# EAGLE schematic Ubo_v1.6_led_topview (EAGLE 9.6.2)
Assembly variants: Variant_2

## Sheet 1 of 7: I2S Audio
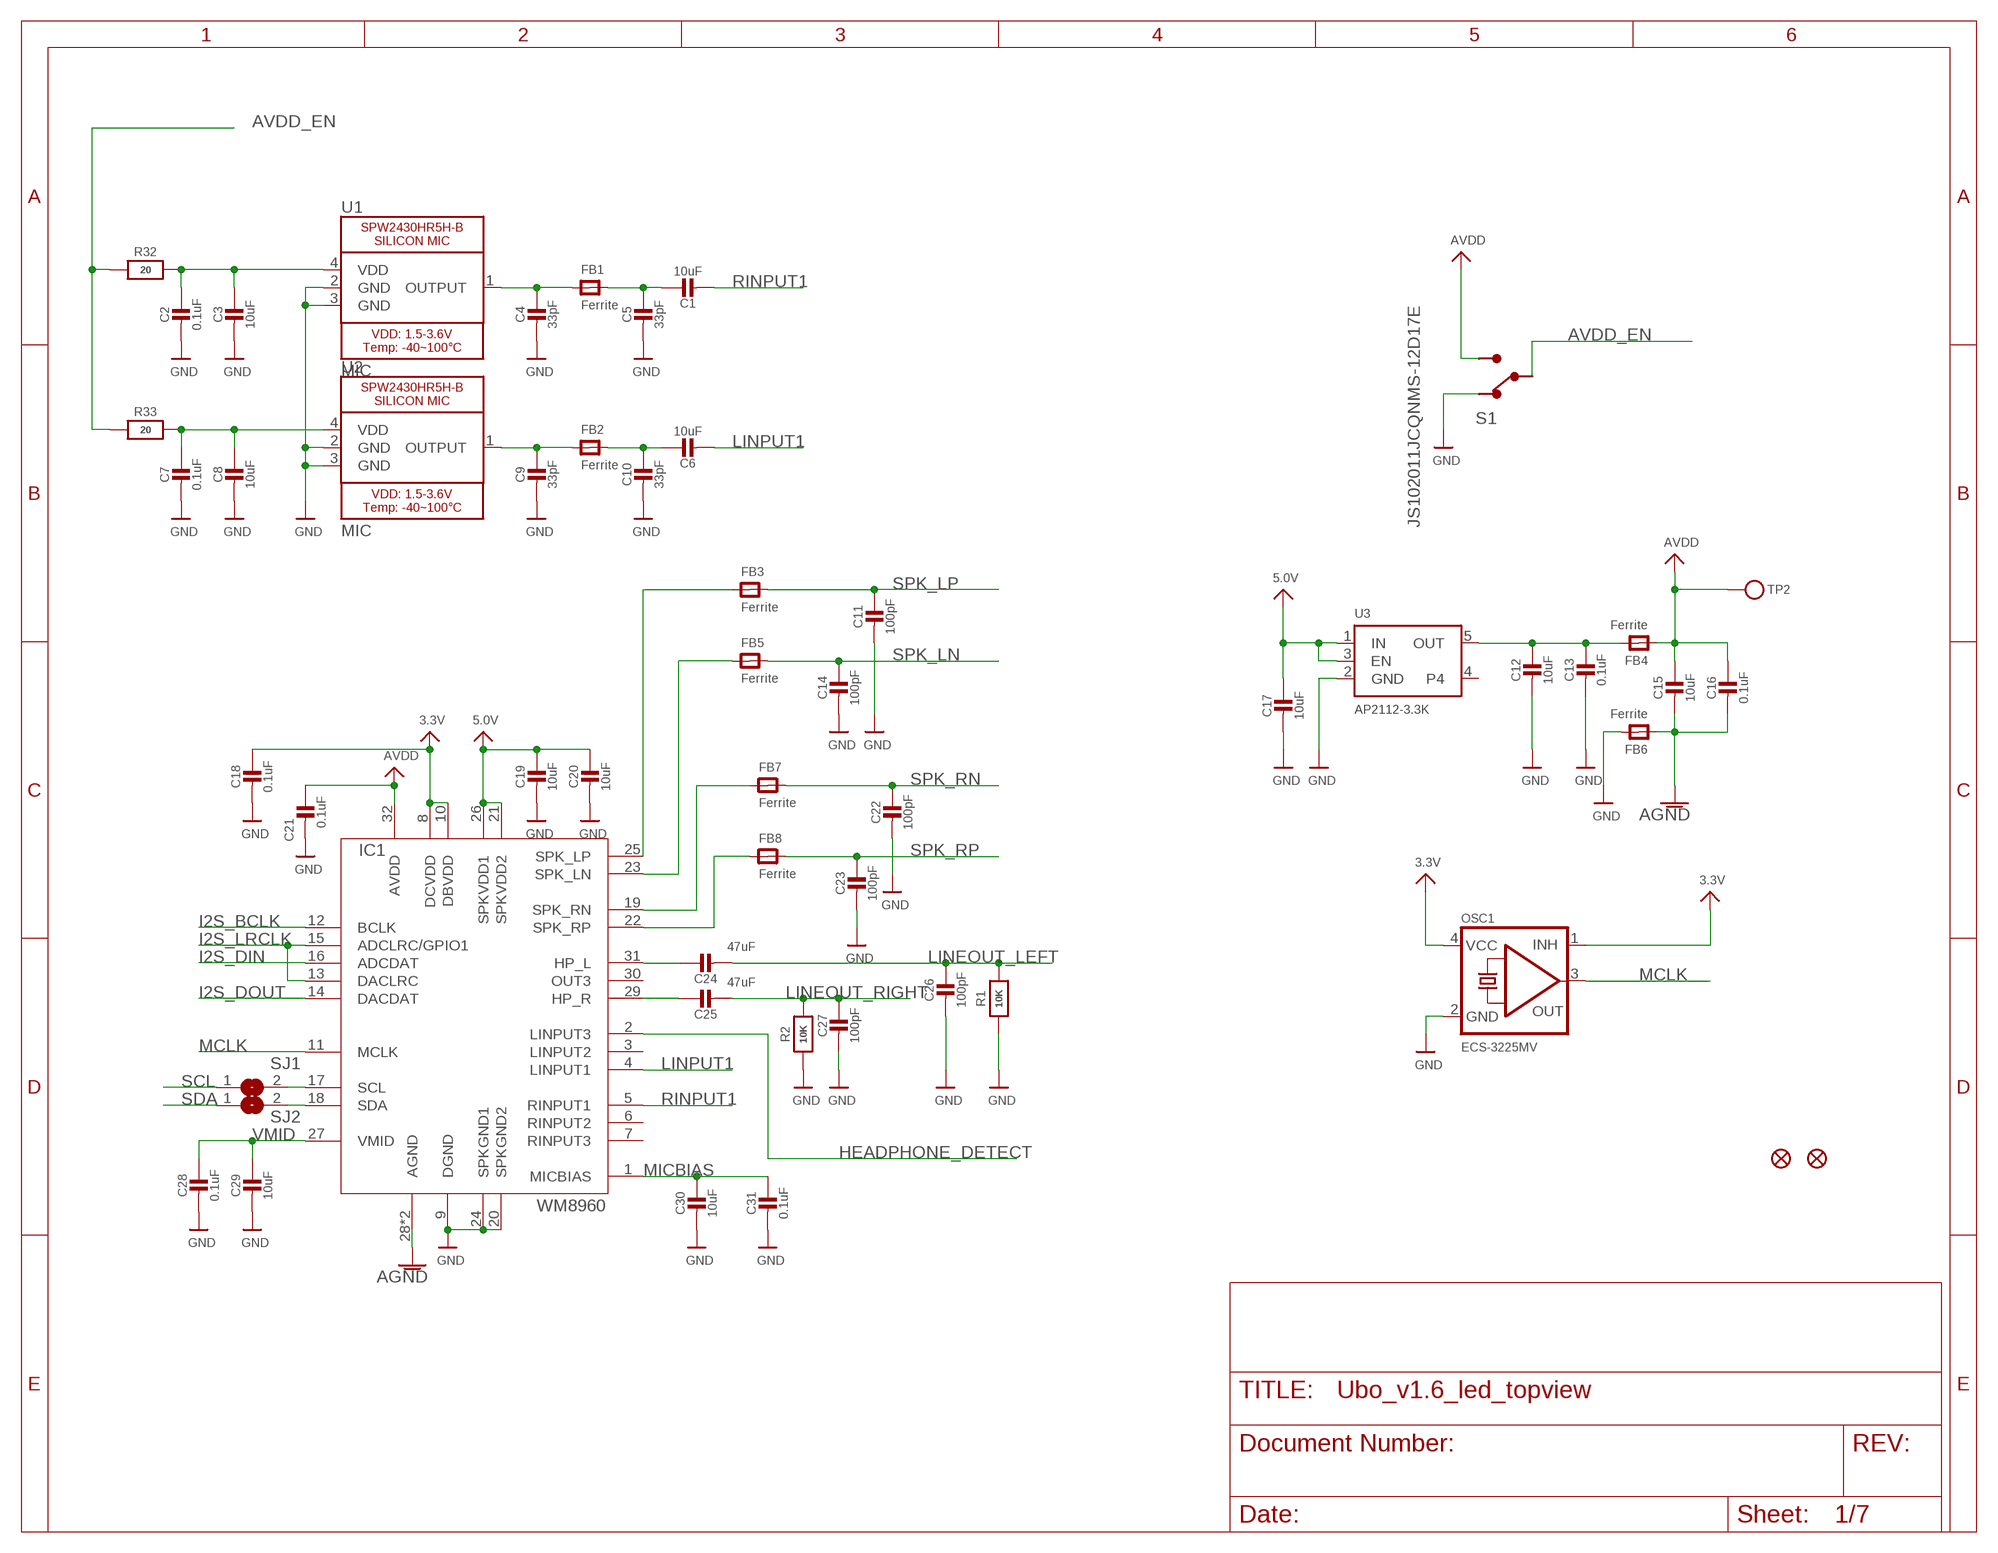
[diagram p0: schematic, sheet 1]

### Parts
C1  10uF  CAP_CERAMIC0805-NOOUTLINE  [0805-NO]  (not fitted in variant Variant_2)
C2  0.1uF  CAP_CERAMIC0603_NO  [0603-NO]  (not fitted in variant Variant_2)
C3  10uF  CAP_CERAMIC0805-NOOUTLINE  [0805-NO]  (not fitted in variant Variant_2)
C4  33pF  CAP_CERAMIC0603_NO  [0603-NO]  (not fitted in variant Variant_2)
C5  33pF  CAP_CERAMIC0603_NO  [0603-NO]  (not fitted in variant Variant_2)
C6  10uF  CAP_CERAMIC0805-NOOUTLINE  [0805-NO]  (not fitted in variant Variant_2)
C7  0.1uF  CAP_CERAMIC0603_NO  [0603-NO]  (not fitted in variant Variant_2)
C8  10uF  CAP_CERAMIC0805-NOOUTLINE  [0805-NO]  (not fitted in variant Variant_2)
C9  33pF  CAP_CERAMIC0603_NO  [0603-NO]  (not fitted in variant Variant_2)
C10  33pF  CAP_CERAMIC0603_NO  [0603-NO]  (not fitted in variant Variant_2)
C11  100pF  CAP_CERAMIC0603_NO  [0603-NO]  (not fitted in variant Variant_2)
C12  10uF  CAP_CERAMIC0805-NOOUTLINE  [0805-NO]  (not fitted in variant Variant_2)
C13  0.1uF  CAP_CERAMIC0603_NO  [0603-NO]  (not fitted in variant Variant_2)
C14  100pF  CAP_CERAMIC0603_NO  [0603-NO]  (not fitted in variant Variant_2)
C15  10uF  CAP_CERAMIC0805-NOOUTLINE  [0805-NO]  (not fitted in variant Variant_2)
C16  0.1uF  CAP_CERAMIC0603_NO  [0603-NO]  (not fitted in variant Variant_2)
C17  10uF  CAP_CERAMIC0805-NOOUTLINE  [0805-NO]  (not fitted in variant Variant_2)
C18  0.1uF  CAP_CERAMIC0603_NO  [0603-NO]  (not fitted in variant Variant_2)
C19  10uF  CAP_CERAMIC0805-NOOUTLINE  [0805-NO]  (not fitted in variant Variant_2)
C20  10uF  CAP_CERAMIC0805-NOOUTLINE  [0805-NO]  (not fitted in variant Variant_2)
C21  0.1uF  CAP_CERAMIC0603_NO  [0603-NO]  (not fitted in variant Variant_2)
C22  100pF  CAP_CERAMIC0603_NO  [0603-NO]  (not fitted in variant Variant_2)
C23  100pF  CAP_CERAMIC0603_NO  [0603-NO]  (not fitted in variant Variant_2)
C24  47uF  CAP_CERAMIC0805-NOOUTLINE  [0805-NO]  (not fitted in variant Variant_2)
C25  47uF  CAP_CERAMIC0805-NOOUTLINE  [0805-NO]  (not fitted in variant Variant_2)
C26  100pF  CAP_CERAMIC0603_NO  [0603-NO]  (not fitted in variant Variant_2)
C27  100pF  CAP_CERAMIC0603_NO  [0603-NO]  (not fitted in variant Variant_2)
C28  0.1uF  CAP_CERAMIC0603_NO  [0603-NO]  (not fitted in variant Variant_2)
C29  10uF  CAP_CERAMIC0805-NOOUTLINE  [0805-NO]  (not fitted in variant Variant_2)
C30  10uF  CAP_CERAMIC0805-NOOUTLINE  [0805-NO]  (not fitted in variant Variant_2)
C31  0.1uF  CAP_CERAMIC0603_NO  [0603-NO]  (not fitted in variant Variant_2)
FB1  Ferrite  FERRITE-0805NO  [0805-NO]  (not fitted in variant Variant_2)
FB2  Ferrite  FERRITE-0805NO  [0805-NO]  (not fitted in variant Variant_2)
FB3  Ferrite  FERRITE-0805NO  [0805-NO]  (not fitted in variant Variant_2)
FB4  Ferrite  FERRITE-0805NO  [0805-NO]  (not fitted in variant Variant_2)
FB5  Ferrite  FERRITE-0805NO  [0805-NO]  (not fitted in variant Variant_2)
FB6  Ferrite  FERRITE-0805NO  [0805-NO]  (not fitted in variant Variant_2)
FB7  Ferrite  FERRITE-0805NO  [0805-NO]  (not fitted in variant Variant_2)
FB8  Ferrite  FERRITE-0805NO  [0805-NO]  (not fitted in variant Variant_2)
FID1  FIDUCIAL_1MM  [FIDUCIAL_1MM]
FID2  FIDUCIAL_1MM  [FIDUCIAL_1MM]
IC1  WM8960  [QFN32_5MM]  (not fitted in variant Variant_2)
OSC1  ECS-3225MV  OSCILLATOR2.5X2  [OSC_2.5X2MM]  (not fitted in variant Variant_2)
R1  10K  RESISTOR_0603_NOOUT  [0603-NO]  (not fitted in variant Variant_2)
R2  10K  RESISTOR_0603_NOOUT  [0603-NO]  (not fitted in variant Variant_2)
R32  20  RESISTOR_0603_NOOUT  [0603-NO]  (not fitted in variant Variant_2)
R33  20  RESISTOR_0603_NOOUT  [0603-NO]  (not fitted in variant Variant_2)
S1  JS102011JCQNMS-12D17E  [SW_MS-12D17E]  (not fitted in variant Variant_2)
SJ1  SJ  [SJ]
SJ2  SJ  [SJ]
TP2  TESTPOINTROUND1MM  [TESTPOINT_ROUND_1MM]
U1  MIC  SPW2430HR5H-B  [SPW2430HR5H-B]  (not fitted in variant Variant_2)
U2  MIC  SPW2430HR5H-B  [SPW2430HR5H-B]  (not fitted in variant Variant_2)
U3  AP2112-3.3K  VREG_SOT23-5  [SOT23-5]  (not fitted in variant Variant_2)

### Nets
3.3V: C18.1 IC1.8(DCVDD) IC1.10(DBVDD) OSC1.1(INH) OSC1.4(VCC) ; also sheet 2,3,4,5,6
5.0V: C17.1 C19.1 C20.1 IC1.21(SPKVDD2) IC1.26(SPKVDD1) U3.1(IN) U3.3(EN) ; also sheet 3,4,7
AGND: C15.2 C16.2 FB6.1 IC1.28(AGND) IC1.33(AGND)
AVDD: C15.1 C16.1 C21.1 FB4.1 IC1.32(AVDD) S1.3 TP2.P$1
AVDD_EN: R32.2 R33.2 S1.2 ; also sheet 5
GND: C2.2 C3.2 C4.2 C5.2 C7.2 C8.2 C9.2 C10.2 C11.2 C12.2 C13.2 C14.2 C17.2 C18.2 C19.2 C20.2 C21.2 C22.2 C23.2 C26.2 C27.2 C28.2 C29.2 C30.2 C31.2 FB6.2 IC1.9(DGND) IC1.20(SPKGND2) IC1.24(SPKGND1) OSC1.2(GND) R1.1 R2.1 S1.1 U1.2(GND) U1.3(GND) U2.2(GND) U2.3(GND) U3.2(GND) ; also sheet 2,3,4,5,6,7
HEADPHONE_DETECT: IC1.2(LINPUT3) ; also sheet 3
I2S_BCLK: IC1.12(BCLK) ; also sheet 3
I2S_DIN: IC1.16(ADCDAT) ; also sheet 3
I2S_DOUT: IC1.14(DACDAT) ; also sheet 3
I2S_LRCLK: IC1.13(DACLRC) IC1.15(ADCLRC/GPIO1) ; also sheet 3
LINEOUT_LEFT: C24.2 C26.1 R1.2 ; also sheet 3
LINEOUT_RIGHT: C25.2 C27.1 R2.2 ; also sheet 3
LINPUT1: C6.2 IC1.4(LINPUT1)
MCLK: IC1.11(MCLK) OSC1.3(OUT)
MICBIAS: C30.1 C31.1 IC1.1(MICBIAS)
N$1: FB7.1 IC1.19(SPK_RN)
N$2: FB8.1 IC1.22(SPK_RP)
N$12: C4.1 FB1.1 U1.1(OUTPUT)
N$13: C9.1 FB2.1 U2.1(OUTPUT)
N$16: C1.1 C5.1 FB1.2
N$17: C6.1 C10.1 FB2.2
N$21: FB3.1 IC1.25(SPK_LP)
N$22: FB5.1 IC1.23(SPK_LN)
N$43: C24.1 IC1.31(HP_L)
N$44: C25.1 IC1.29(HP_R)
N$46: IC1.17(SCL) SJ1.2
N$47: IC1.18(SDA) SJ2.2
N$61: C7.1 C8.1 R33.1 U2.4(VDD)
N$62: C2.1 C3.1 R32.1 U1.4(VDD)
OUT: C12.1 C13.1 FB4.2 U3.5(OUT)
RINPUT1: C1.2 IC1.5(RINPUT1)
SCL: SJ1.1 ; also sheet 3,4,5,6
SDA: SJ2.1 ; also sheet 3,4,5,6
SPK_LN: C14.1 FB5.2 ; also sheet 3
SPK_LP: C11.1 FB3.2 ; also sheet 3
SPK_RN: C22.1 FB7.2 ; also sheet 3
SPK_RP: C23.1 FB8.2 ; also sheet 3
VMID: C28.1 C29.1 IC1.27(VMID)
Unconnected: IC1.3(LINPUT2) IC1.6(RINPUT2) IC1.7(RINPUT3) IC1.30(OUT3) U3.4

## Sheet 2 of 7: TFT Display and LED
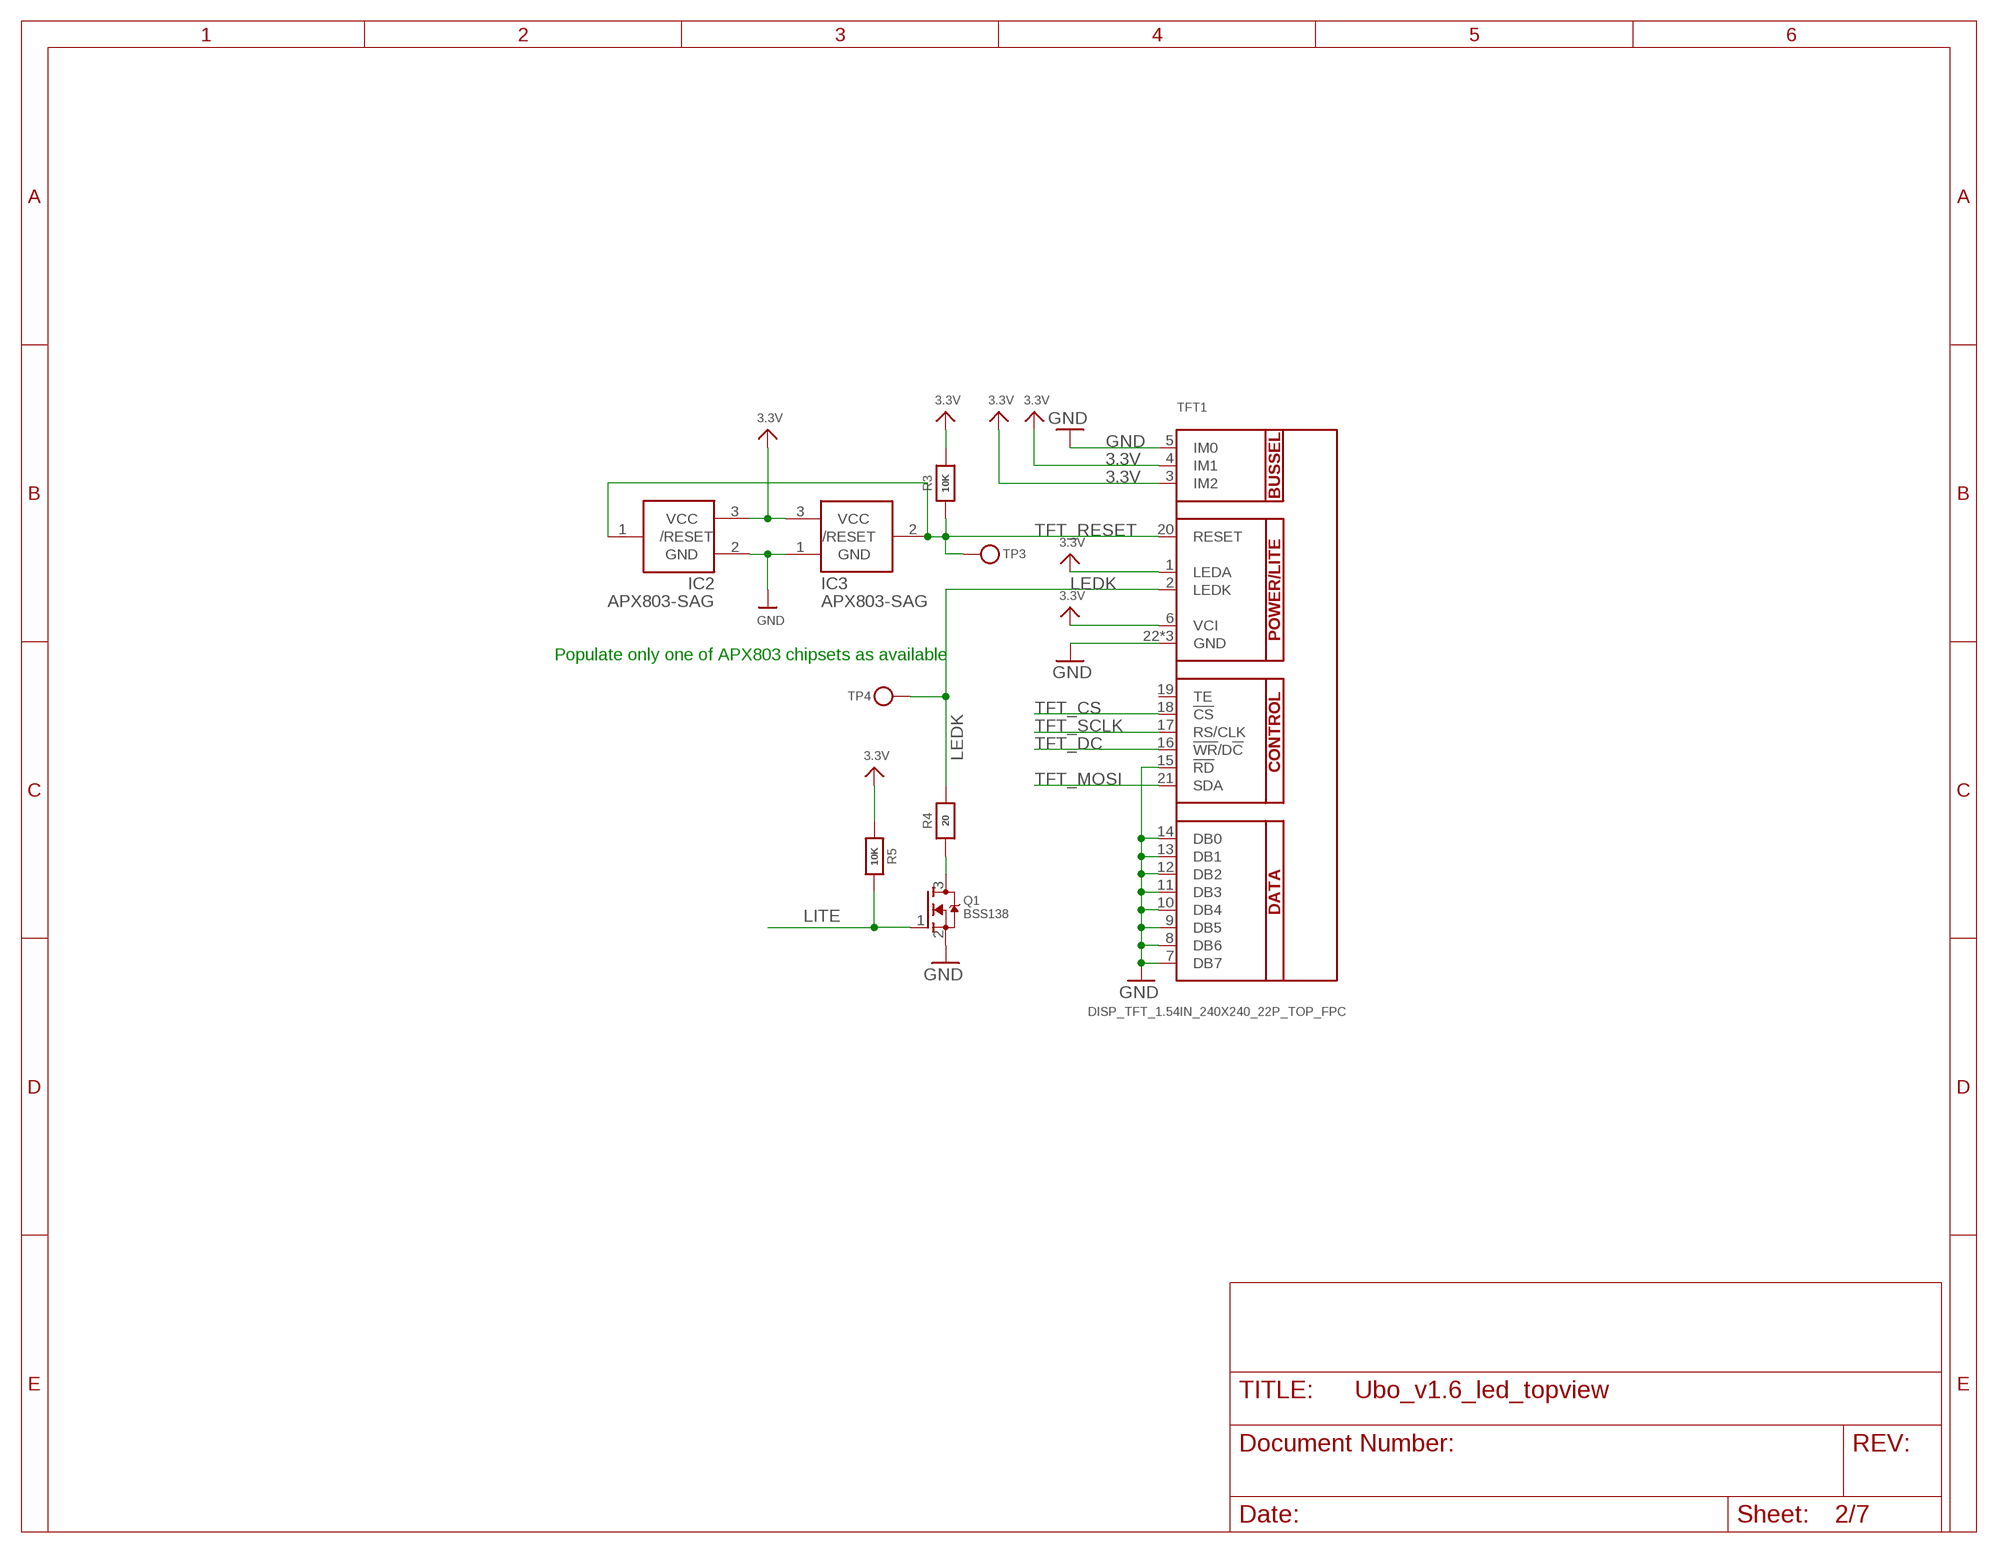
[diagram p1: schematic, sheet 2]

### Parts
IC2  APX803-SAG  AXP083APX803-SR  [SOT23]
IC3  APX803-SAG  AXP083-SAG  [SOT23]
Q1  BSS138  MOSFET-NWIDE  [SOT23-WIDE]
R3  10K  RESISTOR_0603_NOOUT  [0603-NO]
R4  20  RESISTOR_0603_NOOUT  [0603-NO]
R5  10K  RESISTOR_0603_NOOUT  [0603-NO]
TFT1  DISP_TFT_1.54IN_240X240_22P_TOP_FPC  [TFT_1.54IN_240X240_22PN_TOP_FPC]
TP3  TESTPOINTROUND1MM  [TESTPOINT_ROUND_1MM]
TP4  TESTPOINTROUND1MM  [TESTPOINT_ROUND_1MM]

### Nets
3.3V: IC2.3(VCC) IC3.3(VCC) R3.2 R5.2 TFT1.1(LEDA) TFT1.3(IM2) TFT1.4(IM1) TFT1.6(VCI) ; also sheet 1,3,4,5,6
GND: IC2.2(GND) IC3.1(GND) Q1.2(S) TFT1.5(IM0) TFT1.7(DB7) TFT1.8(DB6) TFT1.9(DB5) TFT1.10(DB4) TFT1.11(DB3) TFT1.12(DB2) TFT1.13(DB1) TFT1.14(DB0) TFT1.15(!RD) TFT1.22(GND) TFT1.SUPPORT1(GND) TFT1.SUPPORT2(GND) ; also sheet 1,3,4,5,6,7
LEDK: R4.2 TFT1.2(LEDK) TP4.P$1
LITE: Q1.1(G) R5.1 ; also sheet 3
N$4: Q1.3(D) R4.1
TFT_CS: TFT1.18(!CS) ; also sheet 3
TFT_DC: TFT1.16(!WR!/D!C) ; also sheet 3
TFT_MOSI: TFT1.21(SDA) ; also sheet 3
TFT_RESET: IC2.1(/RESET) IC3.2(/RESET) R3.1 TFT1.20(RESET) TP3.P$1
TFT_SCLK: TFT1.17(RS/CLK) ; also sheet 3
Unconnected: TFT1.19(TE)

### Notes on the sheet
- Populate only one of APX803 chipsets as available

## Sheet 3 of 7: RasPi Hat & Power
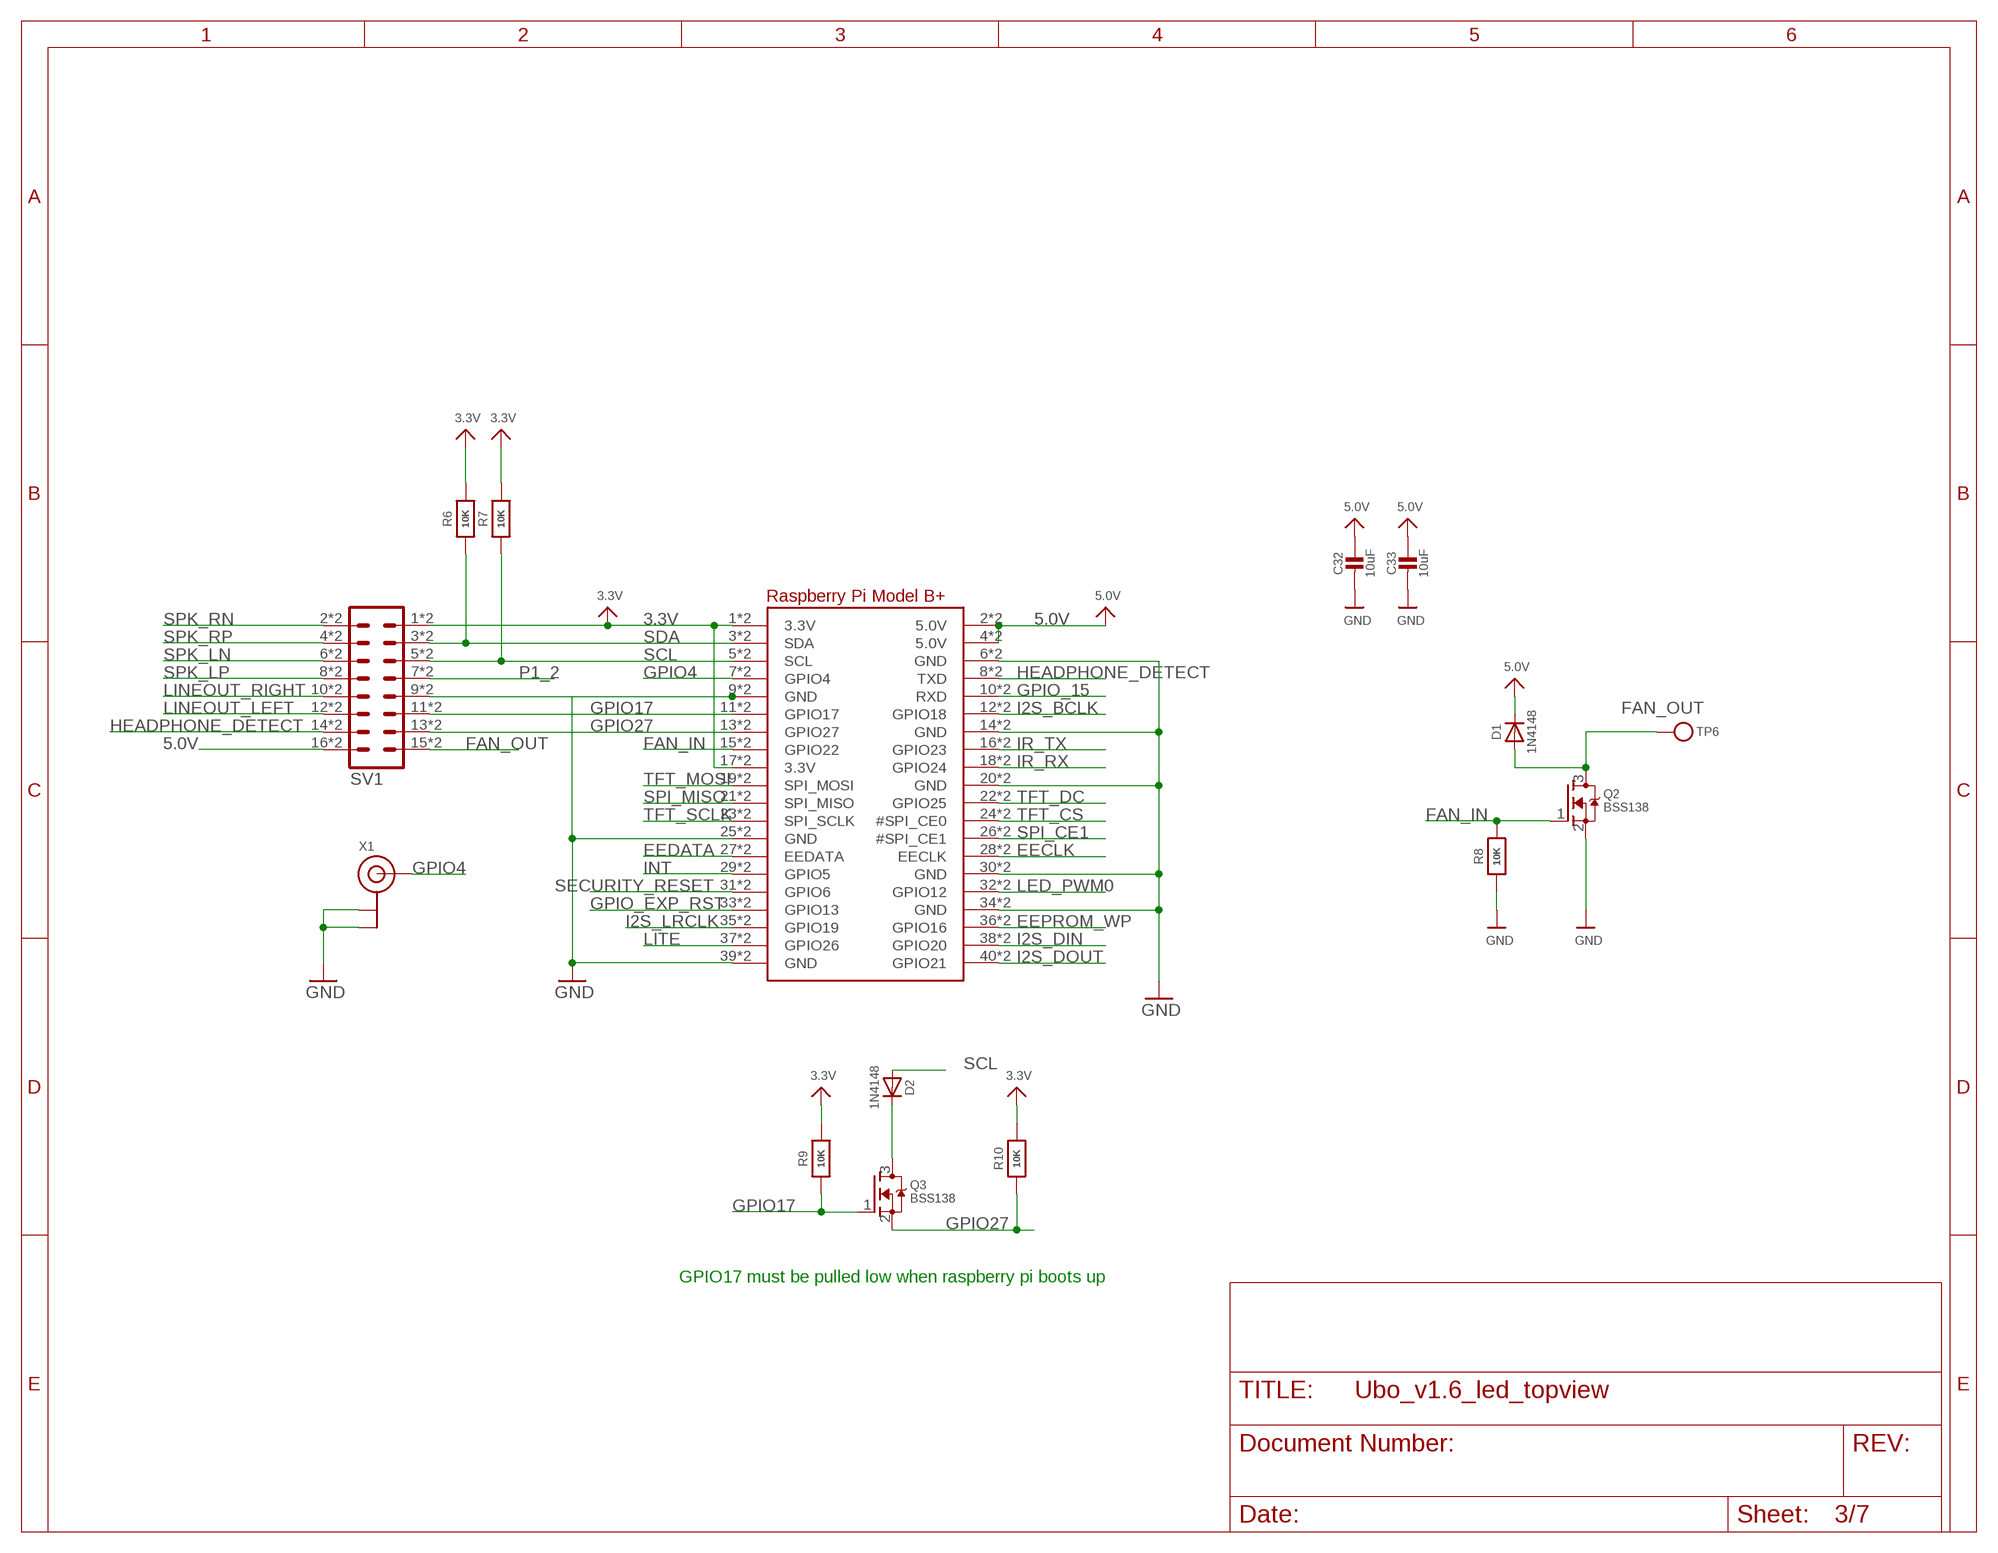
[diagram p2: schematic, sheet 3]

### Parts
C32  10uF  CAP_CERAMIC0805-NOOUTLINE  [0805-NO]
C33  10uF  CAP_CERAMIC0805-NOOUTLINE  [0805-NO]
D1  1N4148  DIODESOD-323  [SOD-323]
D2  1N4148  DIODESOD-323  [SOD-323]
Q2  BSS138  MOSFET-NWIDE  [SOT23-WIDE]
Q3  BSS138  MOSFET-NWIDE  [SOT23-WIDE]
R6  10K  RESISTOR_0603_NOOUT  [0603-NO]
R7  10K  RESISTOR_0603_NOOUT  [0603-NO]
R8  10K  RESISTOR_0603_NOOUT  [0603-NO]
R9  10K  RESISTOR_0603_NOOUT  [0603-NO]
R10  10K  RESISTOR_0603_NOOUT  [0603-NO]
RPI1  RASPBERRYPI_BPLUS_PIN_2X20_SMTTHM  [PI_PIN_2X20_SMTTHM]
SV1  MA08-2  [MA08-2]
TP6  TESTPOINTROUND1MM  [TESTPOINT_ROUND_1MM]
X1  ANTENNA_U.FL  [U.FL]  (not fitted in variant Variant_2)

### Nets
3.3V: R6.1 R7.1 R9.1 R10.1 RPI1.1(3.3V) RPI1.17(3.3V) RPI1.S1(3.3V) RPI1.S17(3.3V) SV1.1 SV1.P$1 ; also sheet 1,2,4,5,6
5.0V: C32.1 C33.1 D1.C RPI1.2(5.0V) RPI1.4(5.0V) RPI1.S2(5.0V) RPI1.S4(5.0V) SV1.16 SV1.P$16 ; also sheet 1,4,7
EECLK: RPI1.28(EECLK) RPI1.S28(EECLK) ; also sheet 6
EEDATA: RPI1.27(EEDATA) RPI1.S27(EEDATA) ; also sheet 6
EEPROM_WP: RPI1.36(GPIO16) RPI1.S36(GPIO16) ; also sheet 6
FAN_IN: Q2.1(G) R8.1 RPI1.15(GPIO22) RPI1.S15(GPIO22)
FAN_OUT: D1.A Q2.3(D) SV1.15 SV1.P$15 TP6.P$1
GND: C32.2 C33.2 Q2.2(S) R8.2 RPI1.6(GND) RPI1.9(GND) RPI1.14(GND) RPI1.20(GND) RPI1.25(GND) RPI1.30(GND) RPI1.34(GND) RPI1.39(GND) RPI1.S6(GND) RPI1.S9(GND) RPI1.S14(GND) RPI1.S20(GND) RPI1.S25(GND) RPI1.S30(GND) RPI1.S34(GND) RPI1.S39(GND) SV1.9 SV1.P$9 X1.1(GND) X1.2(GND) ; also sheet 1,2,4,5,6,7
GPIO4: RPI1.7(GPIO4) RPI1.S7(GPIO4) X1.3(SIGNAL)
GPIO17: Q3.1(G) R9.2 RPI1.11(GPIO17) RPI1.S11(GPIO17) SV1.11 SV1.P$11
GPIO27: Q3.2(S) R10.2 RPI1.13(GPIO27) RPI1.S13(GPIO27) SV1.13 SV1.P$13
GPIO_15: RPI1.10(RXD) RPI1.S10(RXD)
GPIO_EXP_RST: RPI1.33(GPIO13) RPI1.S33(GPIO13) ; also sheet 5
HEADPHONE_DETECT: RPI1.8(TXD) RPI1.S8(TXD) SV1.14 SV1.P$14 ; also sheet 1
I2S_BCLK: RPI1.12(GPIO18) RPI1.S12(GPIO18) ; also sheet 1
I2S_DIN: RPI1.38(GPIO20) RPI1.S38(GPIO20) ; also sheet 1
I2S_DOUT: RPI1.40(GPIO21) RPI1.S40(GPIO21) ; also sheet 1
I2S_LRCLK: RPI1.35(GPIO19) RPI1.S35(GPIO19) ; also sheet 1
INT: RPI1.29(GPIO5) RPI1.S29(GPIO5) ; also sheet 5
IR_RX: RPI1.18(GPIO24) RPI1.S18(GPIO24) ; also sheet 4
IR_TX: RPI1.16(GPIO23) RPI1.S16(GPIO23) ; also sheet 4
LED_PWM0: RPI1.32(GPIO12) RPI1.S32(GPIO12) ; also sheet 7
LINEOUT_LEFT: SV1.12 SV1.P$12 ; also sheet 1
LINEOUT_RIGHT: SV1.10 SV1.P$10 ; also sheet 1
LITE: RPI1.37(GPIO26) RPI1.S37(GPIO26) ; also sheet 2
N$8: D2.C Q3.3(D)
P1_2: SV1.7 SV1.P$7 ; also sheet 5
SCL: D2.A R7.2 RPI1.5(SCL) RPI1.S5(SCL) SV1.5 SV1.P$5 ; also sheet 1,4,5,6
SDA: R6.2 RPI1.3(SDA) RPI1.S3(SDA) SV1.3 SV1.P$3 ; also sheet 1,4,5,6
SECURITY_RESET: RPI1.31(GPIO6) RPI1.S31(GPIO6) ; also sheet 6
SPI_CE1: RPI1.26(#SPI_CE1) RPI1.S26(#SPI_CE1)
SPI_MISO: RPI1.21(SPI_MISO) RPI1.S21(SPI_MISO)
SPK_LN: SV1.6 SV1.P$6 ; also sheet 1
SPK_LP: SV1.8 SV1.P$8 ; also sheet 1
SPK_RN: SV1.2 SV1.P$2 ; also sheet 1
SPK_RP: SV1.4 SV1.P$4 ; also sheet 1
TFT_CS: RPI1.24(#SPI_CE0) RPI1.S24(#SPI_CE0) ; also sheet 2
TFT_DC: RPI1.22(GPIO25) RPI1.S22(GPIO25) ; also sheet 2
TFT_MOSI: RPI1.19(SPI_MOSI) RPI1.S19(SPI_MOSI) ; also sheet 2
TFT_SCLK: RPI1.23(SPI_SCLK) RPI1.S23(SPI_SCLK) ; also sheet 2

### Notes on the sheet
- GPIO17 must be pulled low when raspberry pi boots up

## Sheet 4 of 7: Sensors
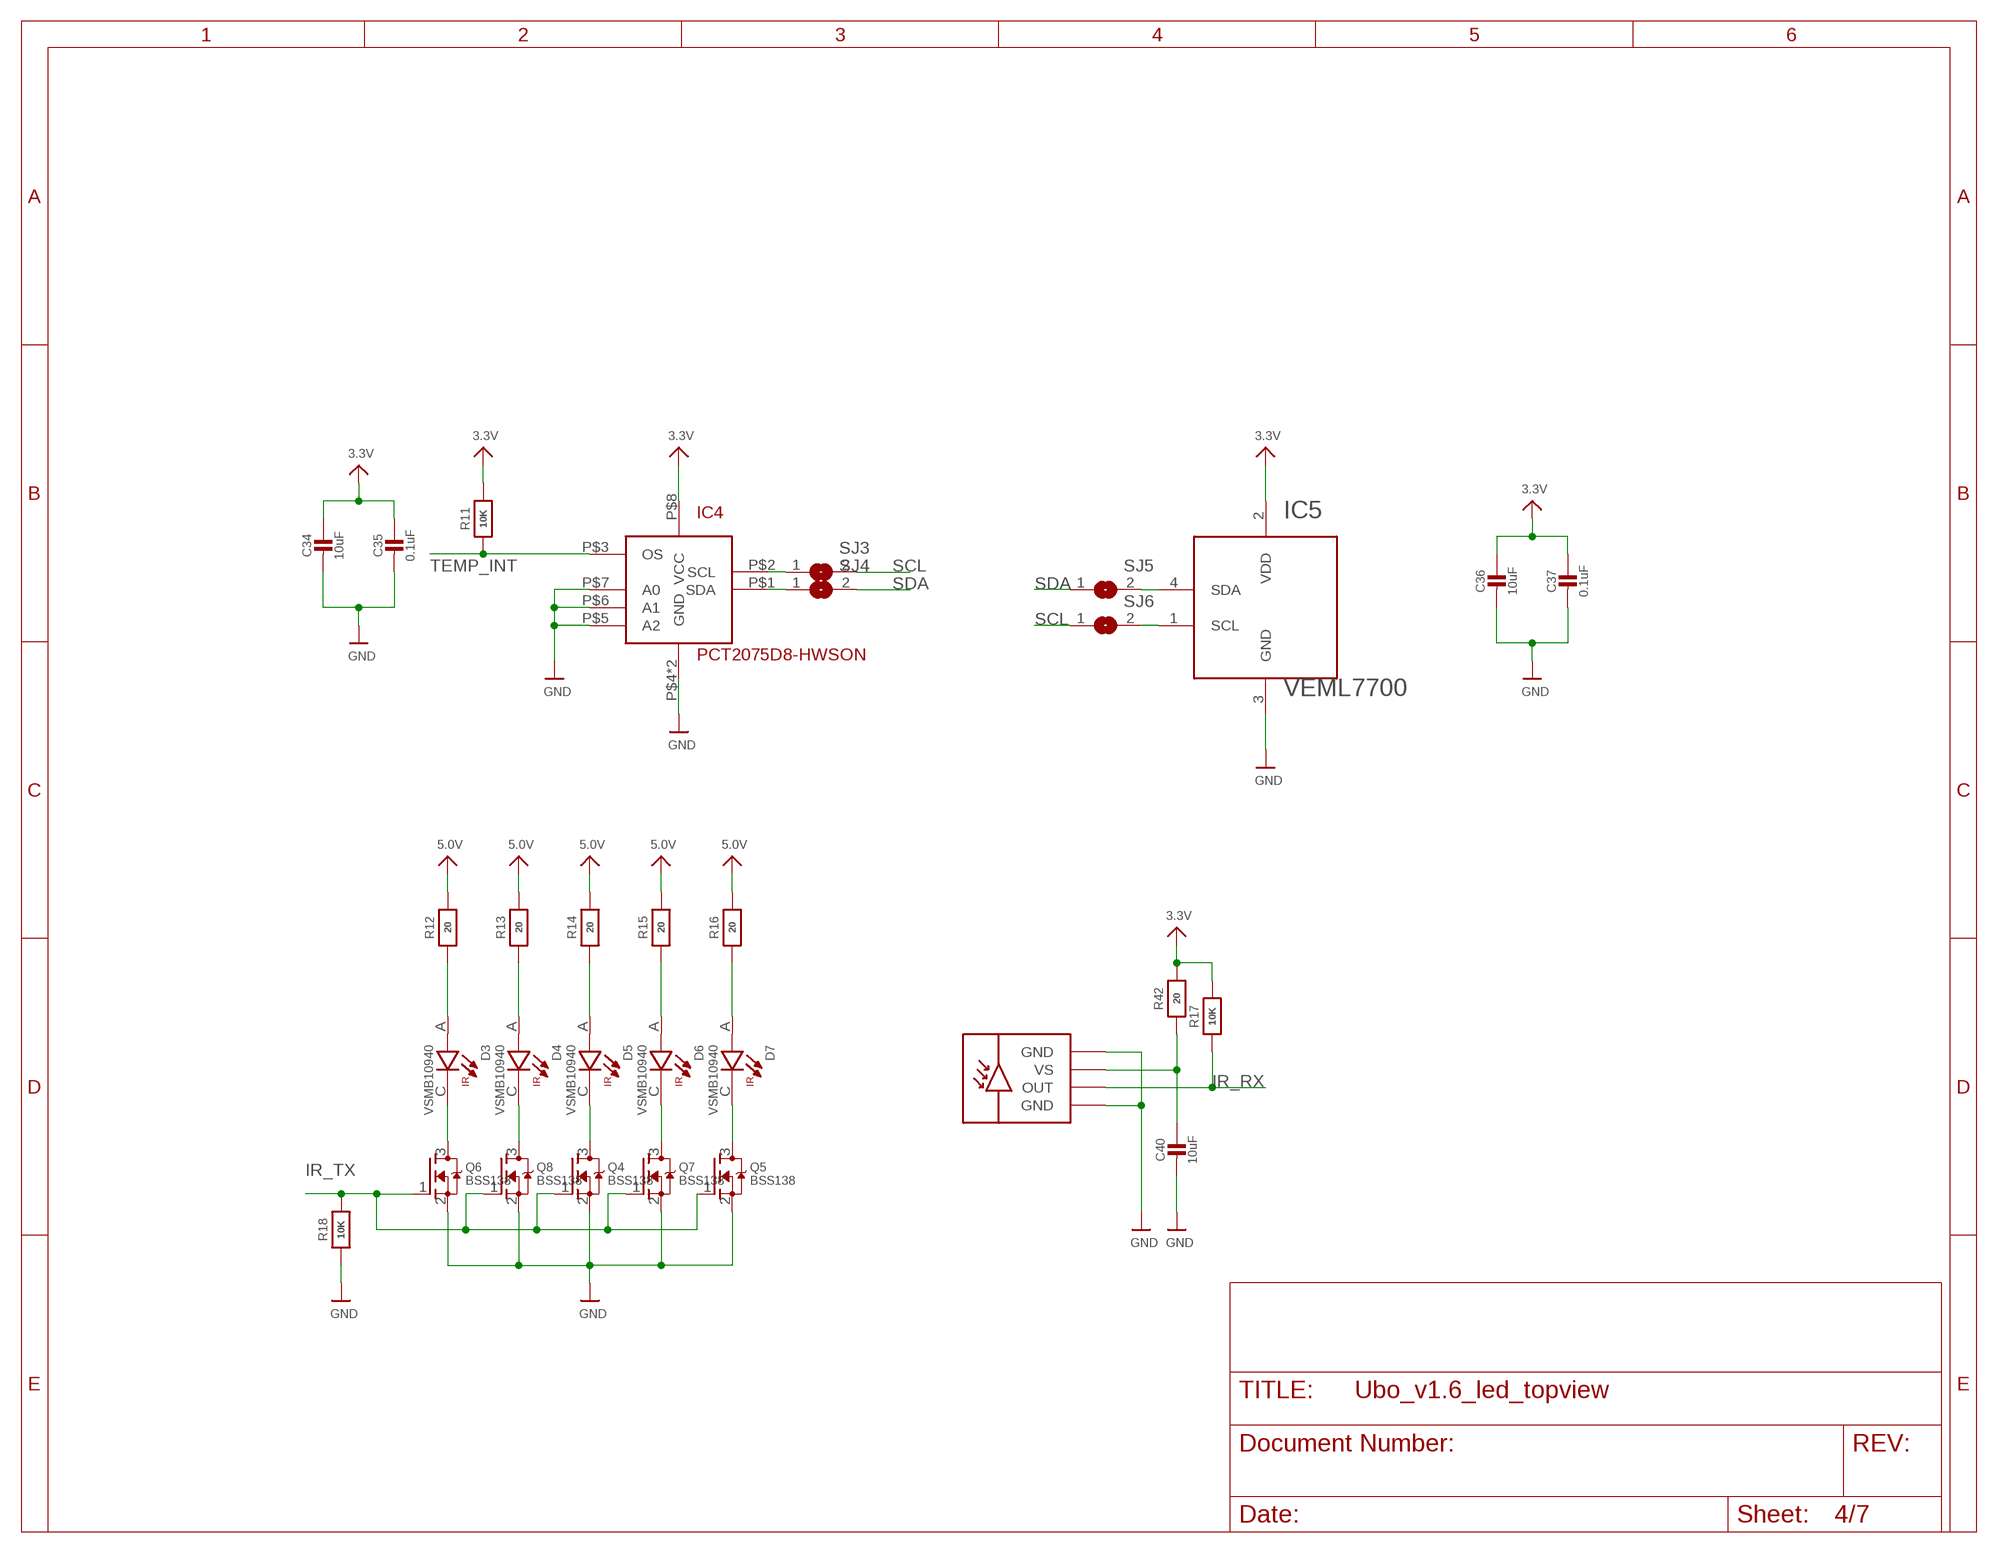
[diagram p3: schematic, sheet 4]

### Parts
C34  10uF  CAP_CERAMIC0805-NOOUTLINE  [0805-NO]
C35  0.1uF  CAP_CERAMIC0603_NO  [0603-NO]
C36  10uF  CAP_CERAMIC0805-NOOUTLINE  [0805-NO]
C37  0.1uF  CAP_CERAMIC0603_NO  [0603-NO]
C40  10uF  CAP_CERAMIC0805-NOOUTLINE  [0805-NO]
D3  VSMB10940  [DIO_VSMB10940]  (not fitted in variant Variant_2)
D4  VSMB10940  [DIO_VSMB10940]  (not fitted in variant Variant_2)
D5  VSMB10940  [DIO_VSMB10940]  (not fitted in variant Variant_2)
D6  VSMB10940  [DIO_VSMB10940]  (not fitted in variant Variant_2)
D7  VSMB10940  [DIO_VSMB10940]  (not fitted in variant Variant_2)
IC4  PCT2075D8-HWSON  [SON127P600X800X80-9N]  (not fitted in variant Variant_2)
IC5  VEML7700  [VEML7700]  (not fitted in variant Variant_2)
IR1  TSMP77000  [TSMP77000]  (not fitted in variant Variant_2)
Q4  BSS138  MOSFET-NWIDE  [SOT23-WIDE]
Q5  BSS138  MOSFET-NWIDE  [SOT23-WIDE]
Q6  BSS138  MOSFET-NWIDE  [SOT23-WIDE]
Q7  BSS138  MOSFET-NWIDE  [SOT23-WIDE]
Q8  BSS138  MOSFET-NWIDE  [SOT23-WIDE]
R11  10K  RESISTOR_0603_NOOUT  [0603-NO]
R12  20  RESISTOR_0603_NOOUT  [0603-NO]
R13  20  RESISTOR_0603_NOOUT  [0603-NO]
R14  20  RESISTOR_0603_NOOUT  [0603-NO]
R15  20  RESISTOR_0603_NOOUT  [0603-NO]
R16  20  RESISTOR_0603_NOOUT  [0603-NO]
R17  10K  RESISTOR_0603_NOOUT  [0603-NO]
R18  10K  RESISTOR_0603_NOOUT  [0603-NO]
R42  20  RESISTOR_0603_NOOUT  [0603-NO]
SJ3  SJ  [SJ]
SJ4  SJ  [SJ]
SJ5  SJ  [SJ]
SJ6  SJ  [SJ]

### Nets
3.3V: C34.1 C35.1 C36.1 C37.1 IC4.P$8(VCC) IC5.2(VDD) R11.1 R17.1 R42.1 ; also sheet 1,2,3,5,6
5.0V: R12.1 R13.1 R14.1 R15.1 R16.1 ; also sheet 1,3,7
GND: C34.2 C35.2 C36.2 C37.2 C40.2 IC4.P$4(GND) IC4.P$5(A2) IC4.P$6(A1) IC4.P$7(A0) IC4.P$9(GND) IC5.3(GND) IR1.P$1(GND) IR1.P$4(GND) Q4.2(S) Q5.2(S) Q6.2(S) Q7.2(S) Q8.2(S) R18.2 ; also sheet 1,2,3,5,6,7
IR_RX: IR1.P$3(OUT) R17.2 ; also sheet 3
IR_TX: Q4.1(G) Q5.1(G) Q6.1(G) Q7.1(G) Q8.1(G) R18.1 ; also sheet 3
N$6: D7.A R16.2
N$7: D3.C Q6.3(D)
N$48: IC5.4(SDA) SJ5.2
N$49: IC5.1(SCL) SJ6.2
N$50: IC4.P$2(SCL) SJ3.1
N$51: IC4.P$1(SDA) SJ4.1
N$54: D6.A R15.2
N$55: D5.A R14.2
N$56: D4.A R13.2
N$57: D3.A R12.2
N$66: D5.C Q4.3(D)
N$67: D4.C Q8.3(D)
N$68: D6.C Q7.3(D)
N$69: D7.C Q5.3(D)
N$70: C40.1 IR1.P$2(VS) R42.2
SCL: SJ3.2 SJ6.1 ; also sheet 1,3,5,6
SDA: SJ4.2 SJ5.1 ; also sheet 1,3,5,6
TEMP_INT: IC4.P$3(OS) R11.2 ; also sheet 5

## Sheet 5 of 7: Buttons and GPIO expansion
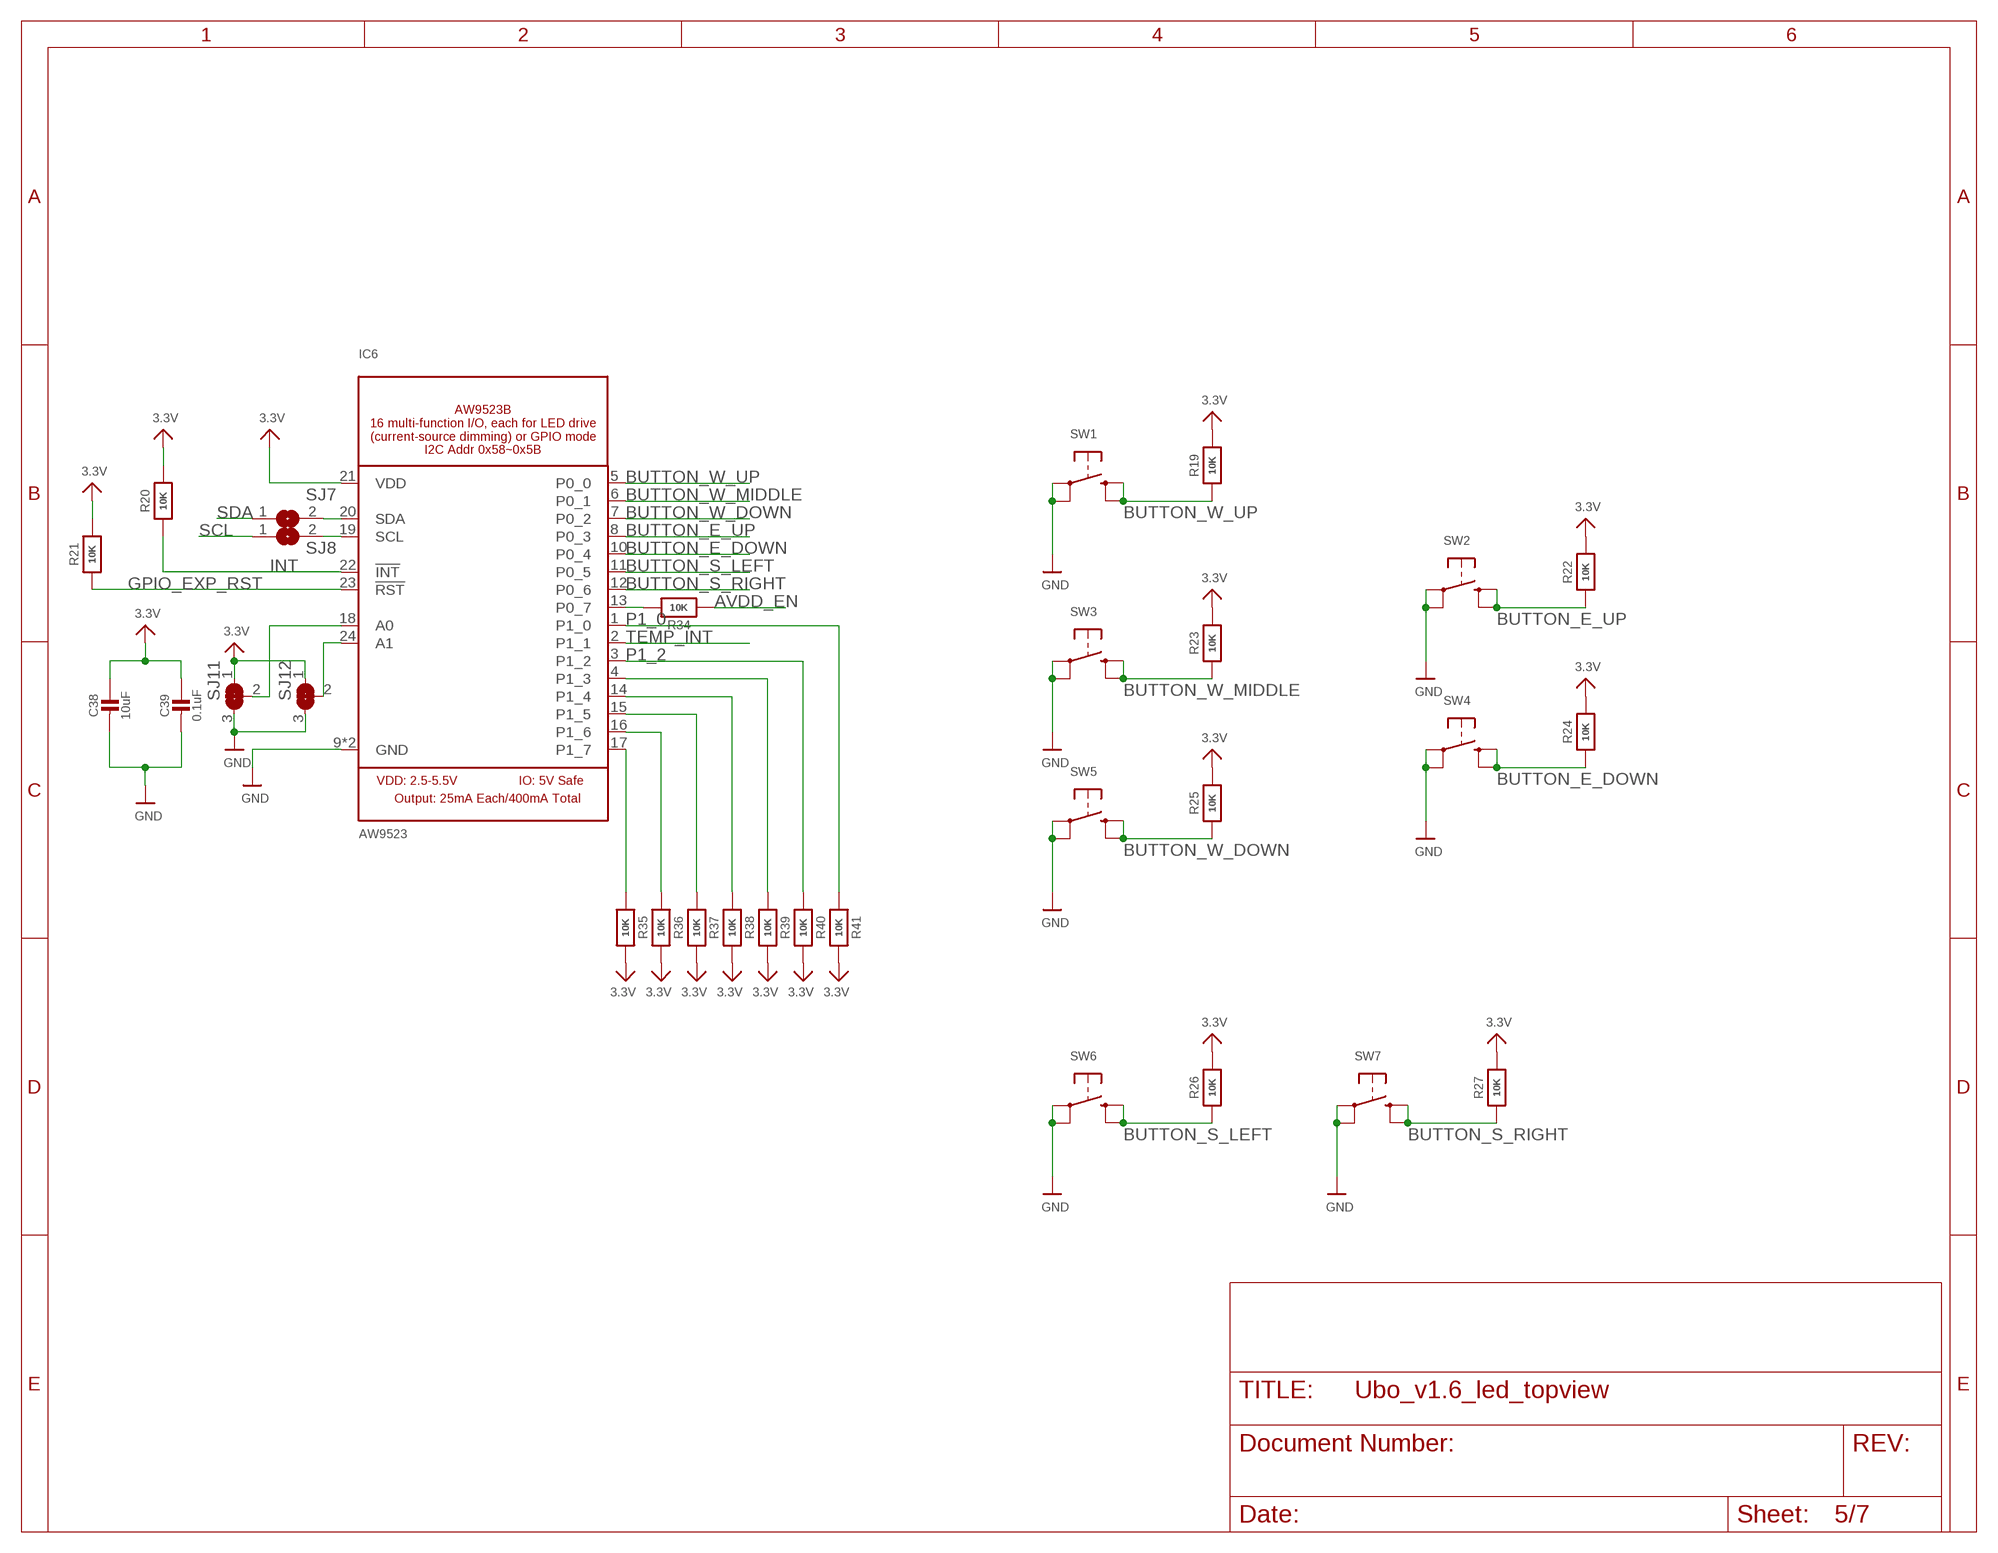
[diagram p4: schematic, sheet 5]

### Parts
C38  10uF  CAP_CERAMIC0805-NOOUTLINE  [0805-NO]
C39  0.1uF  CAP_CERAMIC0603_NO  [0603-NO]
IC6  AW9523  [QFN24_4MM_SMSC]
R19  10K  RESISTOR_0603_NOOUT  [0603-NO]
R20  10K  RESISTOR_0603_NOOUT  [0603-NO]
R21  10K  RESISTOR_0603_NOOUT  [0603-NO]
R22  10K  RESISTOR_0603_NOOUT  [0603-NO]
R23  10K  RESISTOR_0603_NOOUT  [0603-NO]
R24  10K  RESISTOR_0603_NOOUT  [0603-NO]
R25  10K  RESISTOR_0603_NOOUT  [0603-NO]
R26  10K  RESISTOR_0603_NOOUT  [0603-NO]
R27  10K  RESISTOR_0603_NOOUT  [0603-NO]
R34  10K  RESISTOR_0603_NOOUT  [0603-NO]
R35  10K  RESISTOR_0603_NOOUT  [0603-NO]
R36  10K  RESISTOR_0603_NOOUT  [0603-NO]
R37  10K  RESISTOR_0603_NOOUT  [0603-NO]
R38  10K  RESISTOR_0603_NOOUT  [0603-NO]
R39  10K  RESISTOR_0603_NOOUT  [0603-NO]
R40  10K  RESISTOR_0603_NOOUT  [0603-NO]
R41  10K  RESISTOR_0603_NOOUT  [0603-NO]
SJ7  SJ  [SJ]
SJ8  SJ  [SJ]
SJ11  SOLDERJUMPER_2WAY  [SOLDERJUMPER_2WAY_OPEN_NOPASTE]
SJ12  SOLDERJUMPER_2WAY  [SOLDERJUMPER_2WAY_OPEN_NOPASTE]
SW1  E-SWITCH_TL3315NF160QE-SWITCH_TL3315NF160Q_0_0  [E-SWITCH_TL3315NF160Q_0]
SW2  E-SWITCH_TL3315NF160QE-SWITCH_TL3315NF160Q_0_0  [E-SWITCH_TL3315NF160Q_0]
SW3  E-SWITCH_TL3315NF160QE-SWITCH_TL3315NF160Q_0_0  [E-SWITCH_TL3315NF160Q_0]
SW4  E-SWITCH_TL3315NF160QE-SWITCH_TL3315NF160Q_0_0  [E-SWITCH_TL3315NF160Q_0]
SW5  E-SWITCH_TL3315NF160QE-SWITCH_TL3315NF160Q_0_0  [E-SWITCH_TL3315NF160Q_0]
SW6  E-SWITCH_TL3315NF160QE-SWITCH_TL3315NF160Q_0_0  [E-SWITCH_TL3315NF160Q_0]
SW7  E-SWITCH_TL3315NF160QE-SWITCH_TL3315NF160Q_0_0  [E-SWITCH_TL3315NF160Q_0]

### Nets
3.3V: C38.1 C39.1 IC6.21(VDD) R19.1 R20.1 R21.1 R22.1 R23.1 R24.1 R25.1 R26.1 R27.1 R35.1 R36.1 R37.1 R38.1 R39.1 R40.1 R41.1 SJ11.1 SJ12.1 ; also sheet 1,2,3,4,6
AVDD_EN: R34.2 ; also sheet 1
BUTTON_E_DOWN: IC6.10(P0_4) R24.2 SW4.3 SW4.3-2 SW4.4 SW4.4-2
BUTTON_E_UP: IC6.8(P0_3) R22.2 SW2.3 SW2.3-2 SW2.4 SW2.4-2
BUTTON_S_LEFT: IC6.11(P0_5) R26.2 SW6.3 SW6.3-2 SW6.4 SW6.4-2
BUTTON_S_RIGHT: IC6.12(P0_6) R27.2 SW7.3 SW7.3-2 SW7.4 SW7.4-2
BUTTON_W_DOWN: IC6.7(P0_2) R25.2 SW5.3 SW5.3-2 SW5.4 SW5.4-2
BUTTON_W_MIDDLE: IC6.6(P0_1) R23.2 SW3.3 SW3.3-2 SW3.4 SW3.4-2
BUTTON_W_UP: IC6.5(P0_0) R19.2 SW1.3 SW1.3-2 SW1.4 SW1.4-2
GND: C38.2 C39.2 IC6.9(GND) IC6.THERM(GND) SJ11.3 SJ12.3 SW1.1 SW1.1-2 SW1.2 SW1.2-2 SW2.1 SW2.1-2 SW2.2 SW2.2-2 SW3.1 SW3.1-2 SW3.2 SW3.2-2 SW4.1 SW4.1-2 SW4.2 SW4.2-2 SW5.1 SW5.1-2 SW5.2 SW5.2-2 SW6.1 SW6.1-2 SW6.2 SW6.2-2 SW7.1 SW7.1-2 SW7.2 SW7.2-2 ; also sheet 1,2,3,4,6,7
GPIO_EXP_RST: IC6.23(!RST) R21.2 ; also sheet 3
INT: IC6.22(!INT) R20.2 ; also sheet 3
N$5: IC6.20(SDA) SJ7.2
N$9: IC6.19(SCL) SJ8.2
N$10: IC6.4(P1_3) R39.2
N$11: IC6.14(P1_4) R38.2
N$19: IC6.15(P1_5) R37.2
N$38: IC6.16(P1_6) R36.2
N$45: IC6.17(P1_7) R35.2
N$63: IC6.13(P0_7) R34.1
N$64: IC6.24(A1) SJ12.2
N$65: IC6.18(A0) SJ11.2
P1_0: IC6.1(P1_0) R41.2
P1_2: IC6.3(P1_2) R40.2 ; also sheet 3
SCL: SJ8.1 ; also sheet 1,3,4,6
SDA: SJ7.1 ; also sheet 1,3,4,6
TEMP_INT: IC6.2(P1_1) ; also sheet 4

## Sheet 6 of 7: EEPROM & SECURITY
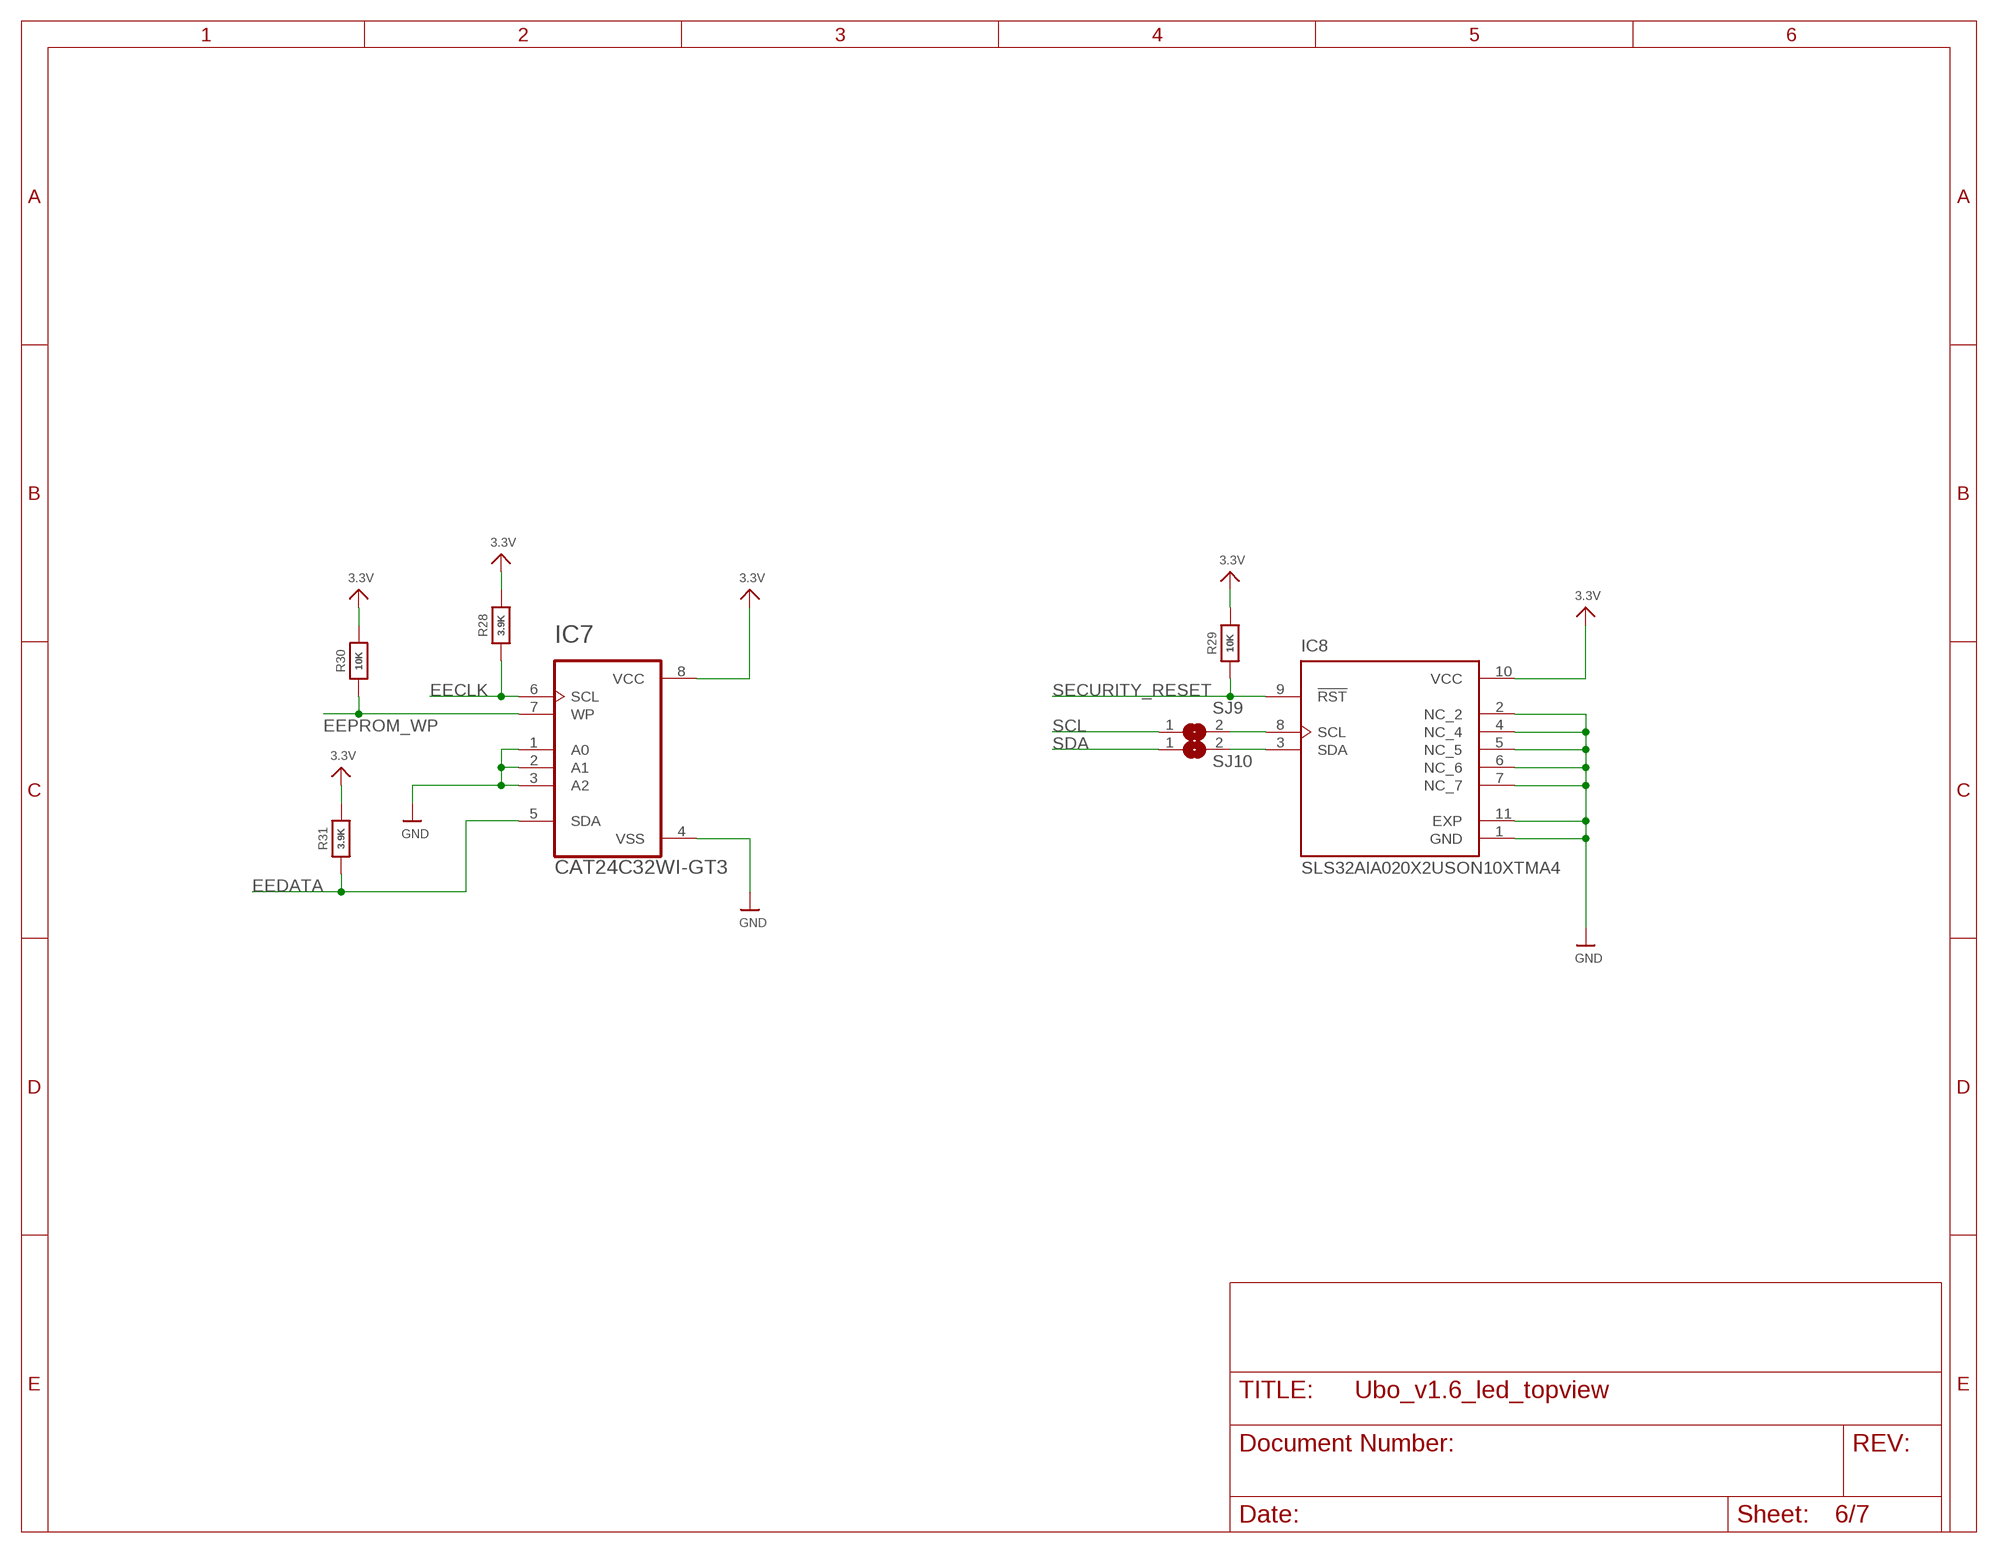
[diagram p5: schematic, sheet 6]

### Parts
IC7  CAT24C32WI-GT3  [SOIC127P600X175-8N]
IC8  SLS32AIA020X2USON10XTMA4  [SON50P300X300X60-11N]  (not fitted in variant Variant_2)
R28  3.9K  RESISTOR_0603_NOOUT  [0603-NO]
R29  10K  RESISTOR_0603_NOOUT  [0603-NO]
R30  10K  RESISTOR_0603_NOOUT  [0603-NO]
R31  3.9K  RESISTOR_0603_NOOUT  [0603-NO]
SJ9  SJ  [SJ]
SJ10  SJ  [SJ]

### Nets
3.3V: IC7.8(VCC) IC8.10(VCC) R28.1 R29.1 R30.1 R31.1 ; also sheet 1,2,3,4,5
EECLK: IC7.6(SCL) R28.2 ; also sheet 3
EEDATA: IC7.5(SDA) R31.2 ; also sheet 3
EEPROM_WP: IC7.7(WP) R30.2 ; also sheet 3
GND: IC7.1(A0) IC7.2(A1) IC7.3(A2) IC7.4(VSS) IC8.1(GND) IC8.2(NC_2) IC8.4(NC_4) IC8.5(NC_5) IC8.6(NC_6) IC8.7(NC_7) IC8.11(EXP) ; also sheet 1,2,3,4,5,7
N$52: IC8.8(SCL) SJ9.2
N$53: IC8.3(SDA) SJ10.2
SCL: SJ9.1 ; also sheet 1,3,4,5
SDA: SJ10.1 ; also sheet 1,3,4,5
SECURITY_RESET: IC8.9(!RST) R29.2 ; also sheet 3

## Sheet 7 of 7: LEDs
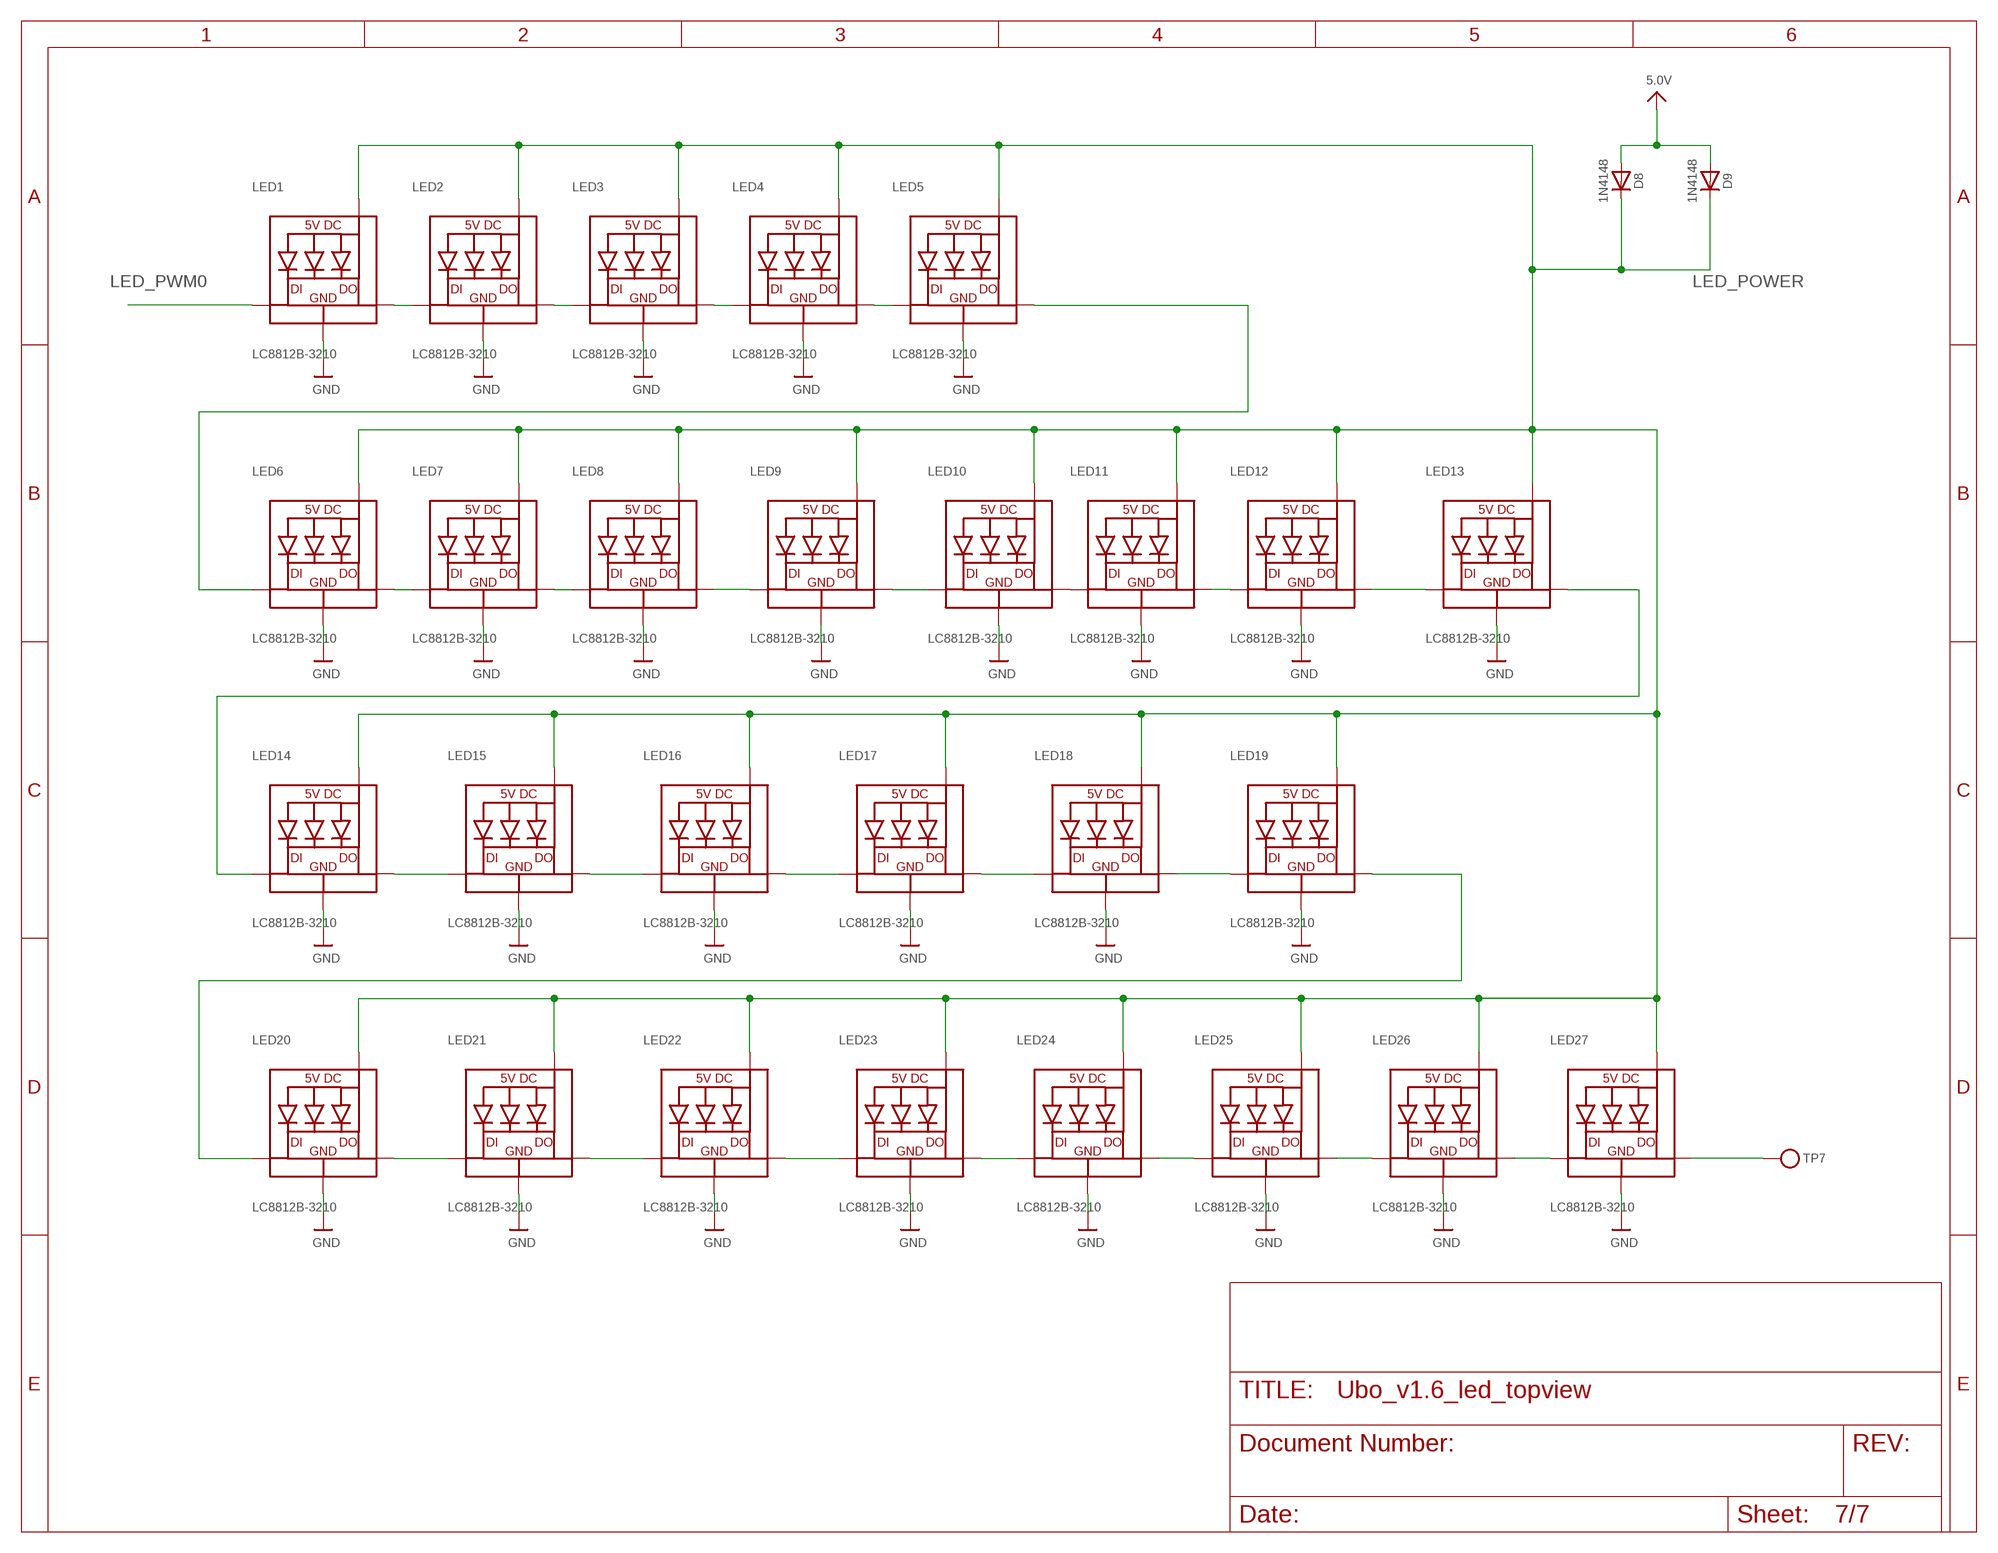
[diagram p6: schematic, sheet 7]

### Parts
D8  1N4148  DIODESOD-323  [SOD-323]
D9  1N4148  DIODESOD-323  [SOD-323]
LED1  LC8812B-3210  LED_SK6812SK6805_1515  [SK6805-EC15]
LED2  LC8812B-3210  LED_SK6812SK6805_1515  [SK6805-EC15]
LED3  LC8812B-3210  LED_SK6812SK6805_1515  [SK6805-EC15]
LED4  LC8812B-3210  LED_SK6812SK6805_1515  [SK6805-EC15]
LED5  LC8812B-3210  LED_SK6812SK6805_1515  [SK6805-EC15]
LED6  LC8812B-3210  LED_SK6812SK6805_1515  [SK6805-EC15]
LED7  LC8812B-3210  LED_SK6812SK6805_1515  [SK6805-EC15]
LED8  LC8812B-3210  LED_SK6812SK6805_1515  [SK6805-EC15]
LED9  LC8812B-3210  LED_SK6812SK6805_1515  [SK6805-EC15]
LED10  LC8812B-3210  LED_SK6812SK6805_1515  [SK6805-EC15]
LED11  LC8812B-3210  LED_SK6812SK6805_1515  [SK6805-EC15]
LED12  LC8812B-3210  LED_SK6812SK6805_1515  [SK6805-EC15]
LED13  LC8812B-3210  LED_SK6812SK6805_1515  [SK6805-EC15]
LED14  LC8812B-3210  LED_SK6812SK6805_1515  [SK6805-EC15]
LED15  LC8812B-3210  LED_SK6812SK6805_1515  [SK6805-EC15]
LED16  LC8812B-3210  LED_SK6812SK6805_1515  [SK6805-EC15]
LED17  LC8812B-3210  LED_SK6812SK6805_1515  [SK6805-EC15]
LED18  LC8812B-3210  LED_SK6812SK6805_1515  [SK6805-EC15]
LED19  LC8812B-3210  LED_SK6812SK6805_1515  [SK6805-EC15]
LED20  LC8812B-3210  LED_SK6812SK6805_1515  [SK6805-EC15]
LED21  LC8812B-3210  LED_SK6812SK6805_1515  [SK6805-EC15]
LED22  LC8812B-3210  LED_SK6812SK6805_1515  [SK6805-EC15]
LED23  LC8812B-3210  LED_SK6812SK6805_1515  [SK6805-EC15]
LED24  LC8812B-3210  LED_SK6812SK6805_1515  [SK6805-EC15]
LED25  LC8812B-3210  LED_SK6812SK6805_1515  [SK6805-EC15]
LED26  LC8812B-3210  LED_SK6812SK6805_1515  [SK6805-EC15]
LED27  LC8812B-3210  LED_SK6812SK6805_1515  [SK6805-EC15]
TP7  TESTPOINTROUND1MM  [TESTPOINT_ROUND_1MM]

### Nets
5.0V: D8.A D9.A ; also sheet 1,3,4
GND: LED1.P$4(GND) LED2.P$4(GND) LED3.P$4(GND) LED4.P$4(GND) LED5.P$4(GND) LED6.P$4(GND) LED7.P$4(GND) LED8.P$4(GND) LED9.P$4(GND) LED10.P$4(GND) LED11.P$4(GND) LED12.P$4(GND) LED13.P$4(GND) LED14.P$4(GND) LED15.P$4(GND) LED16.P$4(GND) LED17.P$4(GND) LED18.P$4(GND) LED19.P$4(GND) LED20.P$4(GND) LED21.P$4(GND) LED22.P$4(GND) LED23.P$4(GND) LED24.P$4(GND) LED25.P$4(GND) LED26.P$4(GND) LED27.P$4(GND) ; also sheet 1,2,3,4,5,6
LED_POWER: D8.C D9.C LED1.P$2(VDD) LED2.P$2(VDD) LED3.P$2(VDD) LED4.P$2(VDD) LED5.P$2(VDD) LED6.P$2(VDD) LED7.P$2(VDD) LED8.P$2(VDD) LED9.P$2(VDD) LED10.P$2(VDD) LED11.P$2(VDD) LED12.P$2(VDD) LED13.P$2(VDD) LED14.P$2(VDD) LED15.P$2(VDD) LED16.P$2(VDD) LED17.P$2(VDD) LED18.P$2(VDD) LED19.P$2(VDD) LED20.P$2(VDD) LED21.P$2(VDD) LED22.P$2(VDD) LED23.P$2(VDD) LED24.P$2(VDD) LED25.P$2(VDD) LED26.P$2(VDD) LED27.P$2(VDD)
LED_PWM0: LED1.P$1(DI) ; also sheet 3
N$3: LED27.P$3(DO) TP7.P$1
N$14: LED1.P$3(DO) LED2.P$1(DI)
N$15: LED2.P$3(DO) LED3.P$1(DI)
N$18: LED3.P$3(DO) LED4.P$1(DI)
N$20: LED4.P$3(DO) LED5.P$1(DI)
N$23: LED6.P$3(DO) LED7.P$1(DI)
N$24: LED7.P$3(DO) LED8.P$1(DI)
N$25: LED9.P$3(DO) LED10.P$1(DI)
N$26: LED10.P$3(DO) LED11.P$1(DI)
N$27: LED14.P$3(DO) LED15.P$1(DI)
N$28: LED15.P$3(DO) LED16.P$1(DI)
N$29: LED16.P$3(DO) LED17.P$1(DI)
N$30: LED17.P$3(DO) LED18.P$1(DI)
N$31: LED20.P$3(DO) LED21.P$1(DI)
N$32: LED21.P$3(DO) LED22.P$1(DI)
N$33: LED22.P$3(DO) LED23.P$1(DI)
N$34: LED23.P$3(DO) LED24.P$1(DI)
N$35: LED5.P$3(DO) LED6.P$1(DI)
N$36: LED13.P$3(DO) LED14.P$1(DI)
N$37: LED19.P$3(DO) LED20.P$1(DI)
N$39: LED11.P$3(DO) LED12.P$1(DI)
N$40: LED12.P$3(DO) LED13.P$1(DI)
N$41: LED24.P$3(DO) LED25.P$1(DI)
N$42: LED25.P$3(DO) LED26.P$1(DI)
N$58: LED8.P$3(DO) LED9.P$1(DI)
N$59: LED18.P$3(DO) LED19.P$1(DI)
N$60: LED26.P$3(DO) LED27.P$1(DI)

## Library data of the parts
C1-C40 = Uno:CAP_CERAMIC: Ceramic Capacitors For new designs, use the packages preceded by an '_' character since they are more reliable: The following footprints should be used on most boards: _0402 - Standard footprint for regular board layouts _0603 - Standard footprint for regular board layouts _0805 - Standard footprint for regular board layouts _1206 - Standard footprint for regular board layouts For extremely tight-pitch boards where space is at a premium, the following 'micro-pitch' footprints can be used (smaller pads, no silkscreen outline, etc.): _0402MP - Micro-pitch footprint for very dense/compact boards _0603MP - Micro-pitch footprint for very dense/compact boards _0805MP - Micro-pitch footprint for very dense/compact boards _1206MP - Micro-pitch footprint for very dense/compact boards
D1 D2 D8 D9 = Uno:DIODE: Diode SMA Model Volts Amps Type Vf Ir Digikey # Notes SSA34-E3 40V 3A Schottky 480mV @ 3A 200uA @ 40V SSA34-E3/61TGITR-ND CDBA120-G 20V 1A Schottky 500mV @ 1A 500uA @ 20V 641-1014-6-ND REEL MBRA210 10V 2A Schottky 350mV @ 2A 700uA @ 10V MBRA210LT3 SOD-123 Model Volts Amps Type Vf Ir Order # Notes BAT54T1G 30V 200mA Schottky 800mV @ 200mA 2uA @ 25V BAT54T1GOSTR-ND B0530W 30V 500mA Schottky 430mV @ 500mA 130uA @ 30V B0530W-FDICT-ND REEL MBR120 20V 1A Schottky 340mV @ 1A MBR120VLSFT1GOSCT-ND SOD-323 Model Volts Amps Type Vf Ir Order # Notes PMEG2005EJ 20V 500mA Schottky 355mV @ 500mA 568-4110-1-ND ZLLS410 10V 570mA Schottky 380mV @ 570mA ZLLS410CT-ND 1N4148WS 75V 150mA Silicon/Simple 1V 1N4148WSFSCT-ND REEL SOD-523 Model Volts Amps Type Vf Ir Order # Notes BAT54XV2 30V 200mA Schottky 0.8V @ 100mA BAT54XV2CT-ND TB751S 30V 30mA Schottky RB751S-40TE61CT-ND SOT23-R/W (R = Solder Paste/Reflow Ovens, W = Hand-Soldering) Model Volts Amps Type Vf Ir Order # Notes BAT54FILM 40V 300mA Schottky 497-7162-1-ND POWERDI-5 Model Volts Amps Type Vf Ir Order # Notes PDS560 60V 5A Schottky 670mV @ 5A 150uA @ 60V PDS560DICT-ND; PURCHASE_URL: https://www.digikey.com/en/products/detail/diodes-incorporated/ZLLS410TA/1767180
D3-D7 = Uno:VSMB10940: 940 nm 65 mA ±75° Surface Mount High Speed Infrared Emitting Diode Check prices <https://pricing.snapeda.com/parts/VSMB10940/Vishay%20Semiconductor/view-part?ref=eda>; AVAILABILITY: Warning; DESCRIPTION: LED IrLED 940nm 2-Pin SMD T/R; MF: Vishay Semiconductor; MP: VSMB10940; PACKAGE: SMD-2 Vishay; PRICE: None; PURCHASE-URL: https://www.digikey.com/en/products/detail/vishay-semiconductor-opto-division/VSMB10940/3915199
FB1-FB8 = Uno:FERRITE: Ferrite Bead 0603 MMZ1608B121C - 120 Ohm @ 100MHz, 600mA, 0.15 Ohm DC Resistance - Digikey: 445-2164-1-ND BK1608HW121-T - 120 Ohm, 600mA Ferrite Chip - Digikey: 587-1876-2-ND 0805 HZ0805B272R-10 - 2.7K Ohm @ 100MHz, 200mA, 0.8 Ohm DC Resistance - Digikey: 240-2504-1-ND (see also Murata BLM21BD272SN1L) MMZ2012Y152B - 1.5K Ohm @ 100MHz, 500mA, 0.4 Ohm DC Resistance - Digikey: 445-1560-1-ND - Mainly for high frequency (80-400MHz) MMZ2012R102A - 1K Ohm @ 100MHz, 500mA, 0.3 Ohm DC Resistance - Digikey: 445-1555-2-ND - More general purpose (10-200MHz)
FID1 FID2 = Uno:FIDUCIAL: Fiducial Alignment Points Various fiducial points for machine vision alignment.; BOM: EXCLUDE
IC1 = Uno:WM8960: IC CODEC CLASS D SPKR DVR - Stereo Audio Interface 24 b - 32-QFN (5x5); AVAILABILITY: low; DATASHEET: https://statics.cirrus.com/pubs/proDatasheet/WM8960_v4.4.pdf; DIGIKEY_PART_NUMBER: 598-WM8960CGEFL/V-ND; MF: Cirrus Logic Inc.; MFN: WM8960CGEFL/V; PACKAGE: 32-VFQFN Exposed Pad; PRICE: 0.9; PURCHASE_URL: https://www.digikey.com/en/products/detail/cirrus-logic-inc/WM8960CGEFL-V/5036712; ROHS: yes; TEMPERATURE_RANGE_HIGH: 85°C; TEMPERATURE_RANGE_LOW: -40°C
IC2 = Uno:AXP083: IC SUPERVISOR 1 CHANNEL SOT23
IC3 = Uno:AXP083: IC SUPERVISOR 1 CHANNEL SOT23; AVAILABILITY: medium; DATASHEET: https://www.diodes.com/assets/Datasheets/APX803S.pdf; DIGIKEY_PART_NUMBER: APX803S00-29SR-7DIDKR-ND; MF: Diodes Incorporated; MPN: APX803S00-29SR-7; PACKAGE: SOT-23-3; PRICE: 0.10; PURCHASE-URL: https://www.digikey.com/en/products/detail/diodes-incorporated/APX803S00-29SR-7/6674547; ROHS: yes
IC4 = Uno:PCT2075D: SENSOR DIGITAL -55C-125C 8HWSON; The PCT2075 is a temperature-to-digital (I2C) converter featuring 1 C accuracy over 25 C to +100 C range.; AVAILABILITY: medium; DATASHEET: https://www.nxp.com/docs/en/data-sheet/PCT2075.pdf; DIGIKEY_PART_NUMBER: 568-10220-6-ND; MF: NXP USA Inc.; MFN: PCT2075TP,147; PACKAGE: 8HWSON; PURCHASE_URL: https://www.digikey.com/en/products/detail/PCT2075TP%2c147/568-10220-1-ND/3991876?itemSeq=362201509; ROHS: yes; TEMPERATURE_RANGE_HIGH: 125°C; TEMPERATURE_RANGE_LOW: -55°C
IC5 = Uno:VEML7700: Optical Sensor Ambient 545nm I²C 4-SMD, J-Lead; DATASHEET: https://www.nxp.com/docs/en/data-sheet/PCT2075.pdf; DIGIKEY_PART_NUMBER: VEML7700DKR-ND; MF: Vishay; MPN: VEML7700-TR; PACKAGE: 4-SMD; PRICE: 0.4; PURCHASE-URL: https://www.digikey.com/en/products/detail/vishay-semiconductor-opto-division/VEML7700-TR/5820243; ROHS: yes; TEMPERATURE_RANGE_HIGH: 85°C; TEMPERATURE_RANGE_LOW: -25°C
IC6 = Uno:AW9523: 16 PORT I2C 400kHz Interface - GPIO I/O Expanders; AVAILABILITY: warning; DATASHEET: https://datasheet.lcsc.com/lcsc/1809192237_AWINIC-Shanghai-Awinic-Tech-AW9523BTQR_C148077.pdf; MF: AWINIC(Shanghai Awinic Tech); MFN: AW9523BTQR; PACKAGE: TQFN-24; PRICE: 0.3; PURCHASE_LINK: https://lcsc.com/product-detail/Interface-I-O-Expanders_AWINIC-Shanghai-Awinic-Tech-AW9523BTQR_C148077.html; TEMPERATURE_RANGE_HIGH: 85℃; TEMPERATURE_RANGE_LOW: -40℃
IC7 = Uno:CAT24C32WI-GT3: CAT24C32 Series 32 Kb (4K X 8) 1.8 V - 5.5 V I2C CMOS Serial EEPROM - SOIC-8 Check prices <https://pricing.snapeda.com/parts/CAT24C32WI-GT3/ON/view-part?ref=eda>; AVAILABILITY: Good; DATASHEET: https://www.onsemi.com/pdf/datasheet/cat24c32-d.pdf; DESCRIPTION: EEPROM Memory IC 32Kb (4K x 8) I²C 1MHz 400ns 8-SOIC; DIGIKEY_PART_NUMBER: CAT24C32WI-GT3DKR-ND; MF: ON; MPN: CAT24C32WI-GT3; PACKAGE: SOIC-8 ON; PRICE: 0.1; PURCHASE-URL: https://www.digikey.com/en/products/detail/on-semiconductor/CAT24C32WI-GT3/1631159; ROHS: yes; SPICEPREFIX: X; TEMPERATURE_RANGE_HIGH: 85°C; TEMPERATURE_RANGE_LOW: -40°C
IC8 = Uno:SLS32AIA020X2USON10XTMA4: OPTIGA Trust X Chip Card and Security Check prices <https://pricing.snapeda.com/parts/SLS32AIA020X2USON10XTMA4/Infineon%20Technologies/view-part?ref=eda>; AVAILABILITY: Good; DESCRIPTION: High-end security controller | Turnkey solution | One-way authentication using ECDSA | Mutual authentication using DTLS client (IETF standard RFC 6347) | Secure communication using DTLS | Compliant with the USB Type-C Authentication standard | I2C interface | Up to 10 KB user memory | Cryptographic support: ECC256, AES128, SHA-256, TRNG, DRNG | PG-USON-10-2 package (3 x 3 mm) | Standard & extended temperature ranges | Full system integration support | Common Criteria Certified EAL6+ (high) hardware | Cryptographic Tool Box based on ECC NIST P256, P384 and SHA256 (sign, verify, key generation, ECDH, session key derivation); MF: Infineon Technologies; MP: SLS32AIA020X2USON10XTMA4; PACKAGE: UFDFN-10 Infineon Technologies; PRICE: None; PURCHASE-URL: https://pricing.snapeda.com/search/part/SLS32AIA020X2USON10XTMA4/?ref=eda
IR1 = Uno:TSMP77000
LED1-LED27 = Uno:LED_SK6812: RGB LED Side View Emitting, SMD, Addressable SK6812 3210 package
OSC1 = Uno:OSCILLATOR: Oscillators 3.2x2.5mm SMT 4.0MHz +/- 50ppm, 3.3V, 9mA, -40/+85°C - Digikey: 535-9752-1-ND 50MHz +/- 50ppm, 3.3V, 8mA, -10/+70°C - Digikey: 478-4792-1-ND 5x7mm SMT 4.0MHz +/-20ppm 3.3V, 20mA, -20/+70°C - Digikey: 535-9329-2-ND 50MHz +/- 25ppm 3.3V, 35mA, -40/+85°C - Digikey: 631-1197-1-ND
Q1-Q8 = Uno:MOSFET-N: N-Channel Mosfet LEGEND VDS: Voltage Drain-Source ID: Drain Current RDS(ON): Drain-Source On-State Resistance VGS(TH): Gate-Source Threshold Voltage CISS: Drain-Source Input Capacitance SOT-23 Name VDS ID RDS(ON) VGS(TH) CISS Order Number 2N7002E 60V 260mA 2.5 Ohm 2.5V @ 250uA 26.7pF @ 25V 2N7002ET1GOSTR-ND BSH103 30V 850mA 400 mOhm 400mV @ 1mA 83pF @ 24V BSH103,235-ND BSS138 60V 320mA 1.6 Ohm 1.5V @ 250uA 50pF @ 10V Mouser: 771-BSS138PW115 DMN2075U-7 20V 4.2A 38 mOhm 1V @ 250 uA 594.3pF @ 10V DMN2075U-7DICT-ND * BSS138 good choice for I2C level-shifting POWERPAK 1212-8 Name VDS ID RDS(ON) VGS(TH) CISS Order Number Si7308DN 60V 6A 58 mOhm 3V @ 250uA 665pF @ 15V SI7308DN-T1-E3CT-ND
R1-R42 = Uno:RESISTOR: Resistors For new designs, use the packages preceded by an '_' character since they are more reliable: The following footprints should be used on most boards: _0402 - Standard footprint for regular board layouts _0603 - Standard footprint for regular board layouts _0805 - Standard footprint for regular board layouts _1206 - Standard footprint for regular board layouts For extremely tight-pitch boards where space is at a premium, the following 'micro-pitch' footprints can be used (smaller pads, no silkscreen outline, etc.): _0402MP - Micro-pitch footprint for very dense/compact boards _0603MP - Micro-pitch footprint for very dense/compact boards _0805MP - Micro-pitch footprint for very dense/compact boards _1206MP - Micro-pitch footprint for very dense/compact boards
RPI1 = Uno:RASPBERRYPI_BPLUS
S1 = Uno:JS102011JCQN: Switch Slide Spdt 300ma 6v
SJ1-SJ10 = Uno:SJ: SMD solder JUMPER
SJ11 SJ12 = Uno:SOLDERJUMPER_2WAY: 2-Way Solder Jumper
SV1 = Uno:MA08-2: PIN HEADER; OC_FARNELL: unknown; OC_NEWARK: unknown
SW1-SW7 = Uno:E-SWITCH_TL3315NF160Q: SWITCH TACTILE SPST-NO 0.05A 15V; CENTROID_NOT_SPECIFIED: No; DATASHEET: http://media.digikey.com/pdf/Data%20Sheets/E-Switch%20PDFs/TL3315.pdf; DIGIKEY_PART_NUMBER: EG4621CT-ND; MF: E-Switch; MOUSER_PART_NUMBER: 612-TL3315NF160Q; MPN: TL3315NF160Q; PACKAGE: SW_SMT_4MM5_4MM5; PREFIX: SW; PRICE: 0.02; PURCHASE-URL: https://www.digikey.sg/product-detail/en/e-switch/TL3315NF160Q/EG4621CT-ND/1870401; ROHS: yes; TEMPERATURE_RANGE_HIGH: +70°C; TEMPERATURE_RANGE_LOW: -20°C
TFT1 = Uno:DISP_TFT_1.54IN_240X240_22P
TP2-TP4 TP6 TP7 = Uno:TESTPOINT: Test Point Various test points for characterisation and PCB testing TESTPOINT_SMT - Compact Surface Mount Test Point [Digikey: 5016KTR-ND]
U1 U2 = Uno:SPW2430HR5H-B: SPW2430HR5H-B - Silicon Microphone; MAMET MIC ANALOG TOP PORT; AVAILABILITY: good; DATASHEET: https://www.knowles.com/docs/default-source/model-downloads/spw2430hr5h-b.pdf; DIGIKEY_PART_NUMBER: 423-1394-2-ND; MN: Knowles; MPN: SPW2430HR5H-B; PRICE: 0.25; PURCHASE-URL: https://www.digikey.com/en/products/detail/knowles/SPW2430HR5H-B/5052768; ROHS: yes
U3 = Uno:VREG_SOT23-5: SOT23-5 Fixed Voltage Regulators Part Current Out V Out V In V Dropout θJA (°C/W) TJ (°C) Digikey Part No. ADP121 150mA 3.3V 3.4-5.5V 0.09V @ 150mA -- -- ADP121-AUJZ33R7CT-ND ADP121 150mA 3.0V 3.1-5.5V 0.09V @ 150mA -- -- ADP121-AUJZ30R7CT-ND ADP122 300mA 3.3V 3.4-5.5V 0.085V @ 300mA -- -- ADP122AUJZ-3.3-R7CT-ND ADP1712 300mA 3.3V 3.5-5.5V 0.17V @ 300mA -- -- ADP1712AUJZ-3.3-R7TR-ND AP7311 (Low Cost) 150mA 3.3V 3.5-6V 0.15V @ 150mA -- -- AP7311-33WG-7DICT-ND LD39015M18R 150mA 1.8V 1.9V-5.5V 0.08V @ 100mA -- -- 497-6977-1-ND LP2985A-33DBVR 150mA 3.3V 3.3-16V 0.28V @ 150mA 206 150 296-18479-1-ND MCP1824T-3302E/OT 300mA 3.3V 3.5V-6V 0.2V @ 300mA -- -- MCP1824T-3302E/OTCT-ND MIC5205-2.5YM5 TR 150mA 2.5V 2.7-16V 0.165V @ 150mA -- -- 576-1257-2-ND MIC5205-3.0YM5 TR 150mA 3.0V 3.2V-16V 0.165V @ 150mA -- -- 576-1258-2-ND MIC5205-3.3YM5 TR 150mA 3.3V 3.5V-16V 0.165V @ 150mA -- -- 576-1259-2-ND TPS780330220 150mA 3.3V+2.2V 3.6-5.5V 250mV Max -- -- 296-23332-1-ND TDA3663/N1,135 100mA 3.3V 3.5-45V 0.18V @ 50mA -- -- 568-5343-1-ND Max operating temp can be calculated using θJA, TJ (max junction temperature), and power in watts. Set the "Maximum Ambient Temperature" until it reaches TJ ("Max Junction Temperature"), which is the absolute limit for safe use of the regulator: Heat Sink Temperature Calculator <http://www.daycounter.com/Calculators/Heat-Sink-Temperature-Calculator.phtml> For example, With 12V source into a 3.3V LP2985 and a 30mA load, we are dissipating (12V-3.3V) * 0.03A = 0.261W. With a θJA of 206 °C/W, a TJ of 150°C, and 261mW we can safely use the chip without a heat sink up to 75°C (=147.1°C Junction Temperature).; DIGIKEY_PART_NUMBER: MCP1824T-3302E/OTCT-ND
X1 = adafruit:ANTENNA_U.FL: U.FL Antenna Connector

## Net classes
1 power: width 0.406 mm
2 i2c: width 0.203 mm